# EAGLE design SELFiSSH (EAGLE 6.2)

## Sheet 1 of 5: Supply or Battery Mode
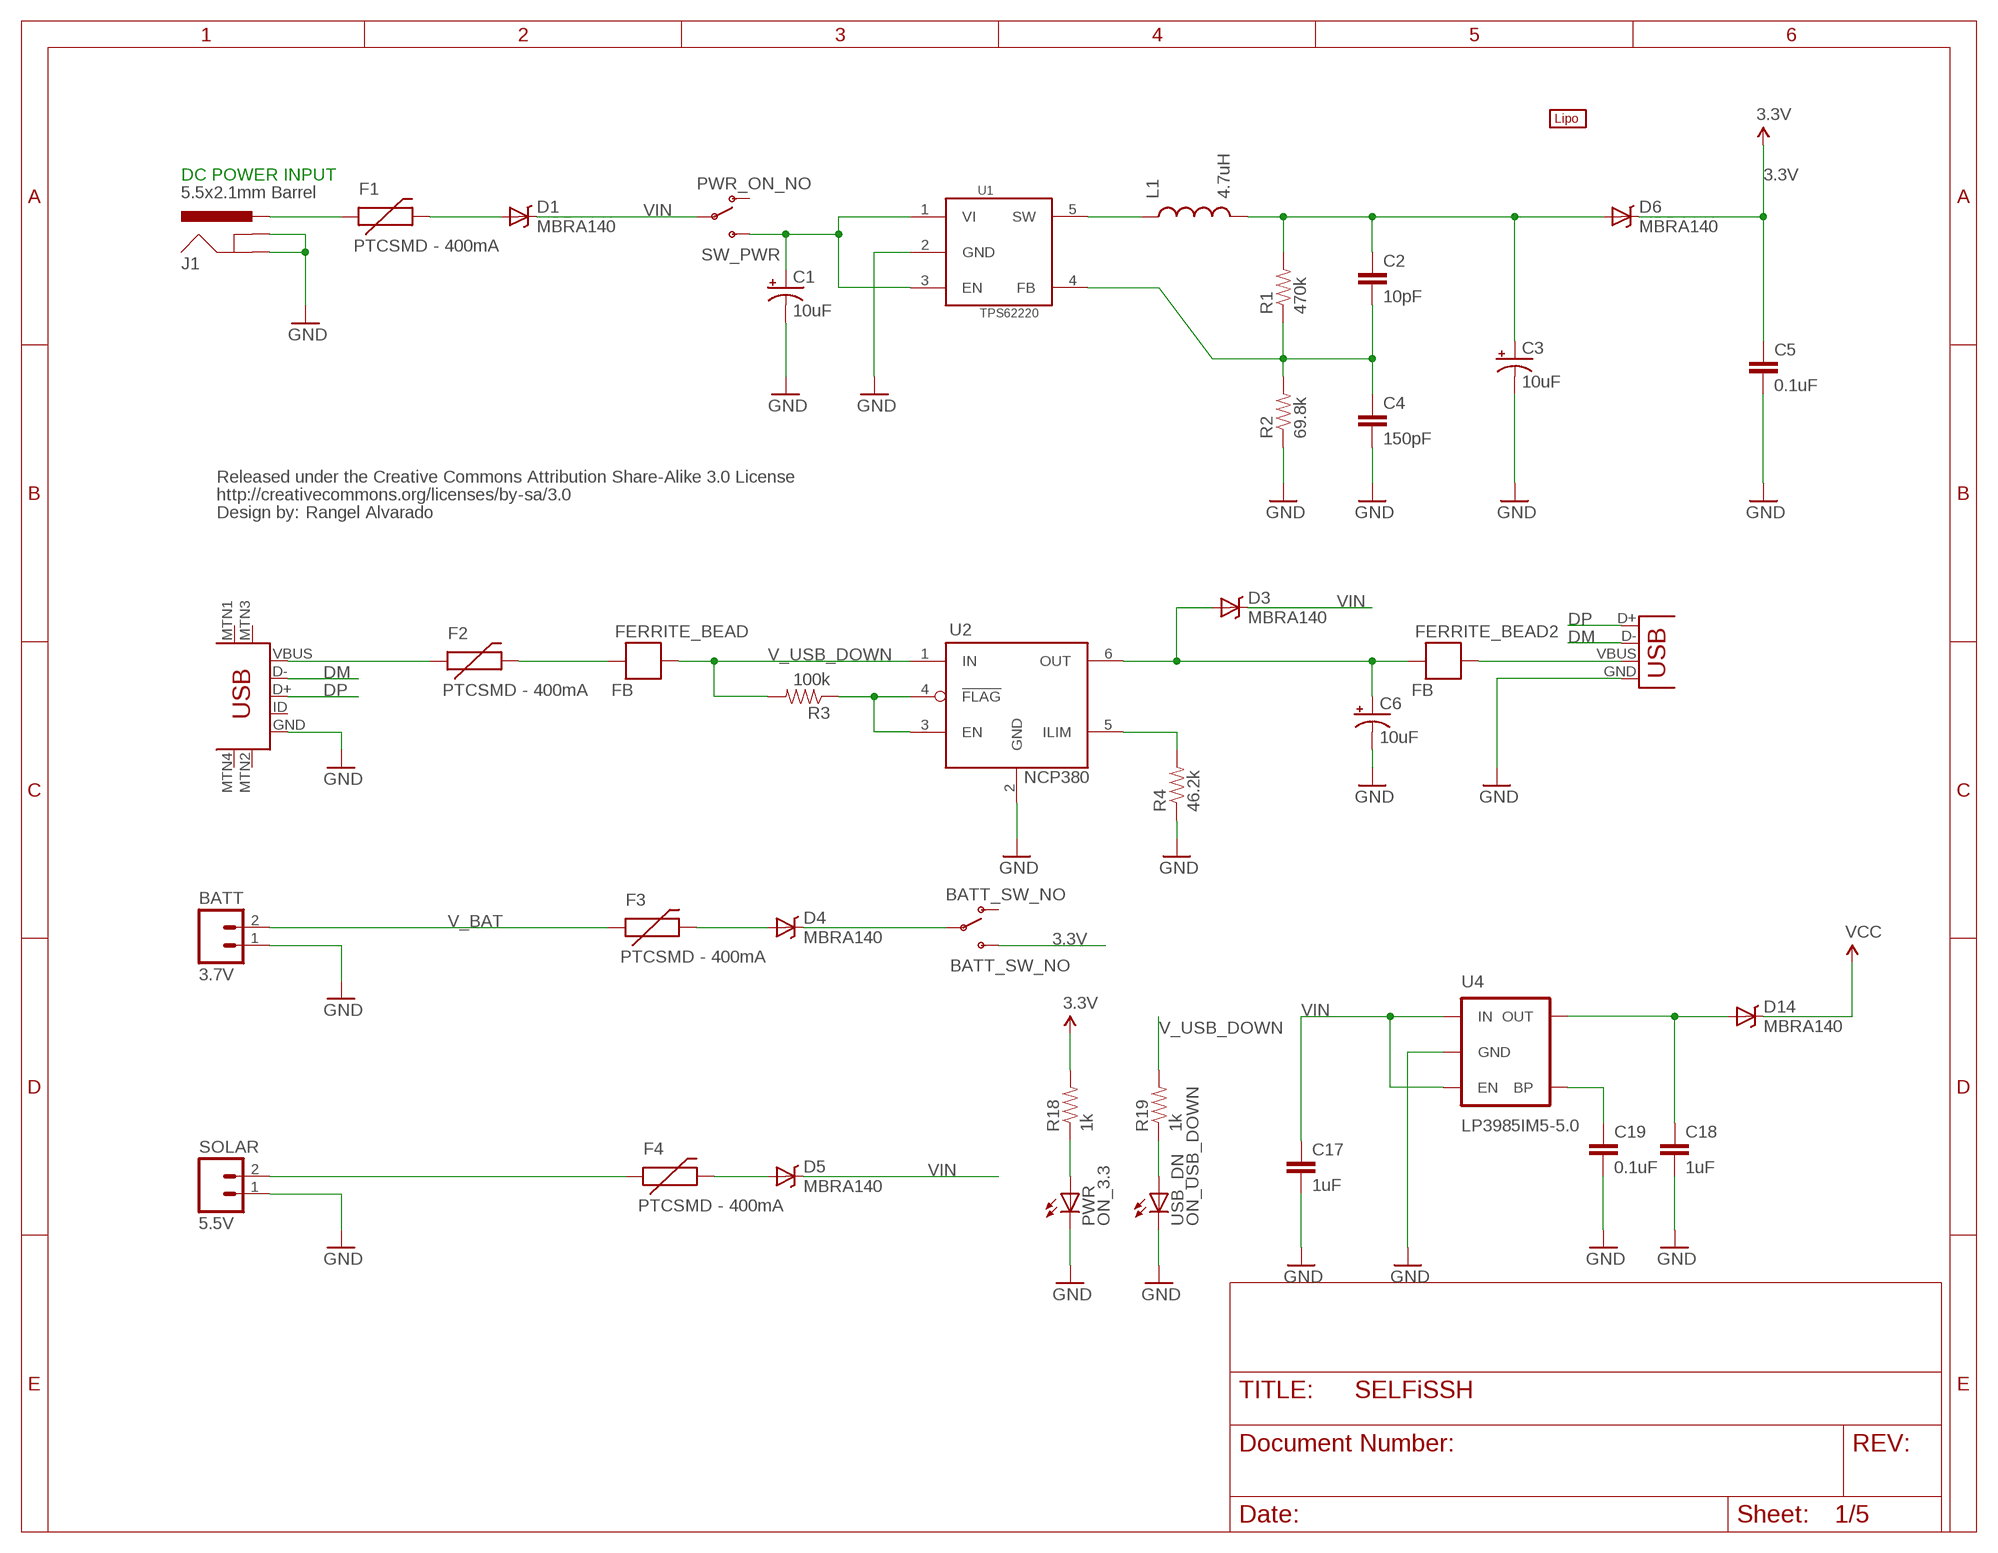
[diagram p0: schematic, sheet 1]

### Parts
BATT  3.7V  M02JST-PTH-2  [JST-2-PTH]
BATT_SW_NO  BATT_SW_NO  SWITCH-SPDTSMD2  [SWITCH-SPDT-SMD]
C1  10uF  10UF-16V-10%(TANT)  [EIA3216]
C2  10pF  1UF-25V-10%(0805)  [0805]
C3  10uF  10UF-16V-10%(TANT)  [EIA3216]
C4  150pF  1UF-25V-10%(0805)  [0805]
C5  0.1uF  1UF-25V-10%(0805)  [0805]
C6  10uF  10UF-16V-10%(TANT)  [EIA3216]
C17  1uF  1UF-25V-10%(0805)  [0805]
C18  1uF  1UF-25V-10%(0805)  [0805]
C19  0.1uF  1UF-25V-10%(0805)  [0805]
CC_TEXT1  CREATIVE_COMMONS  [CREATIVE_COMMONS]
D1  MBRA140  [SMA-DIODE]
D3  MBRA140  [SMA-DIODE]
D4  MBRA140  [SMA-DIODE]
D5  MBRA140  [SMA-DIODE]
D6  MBRA140  [SMA-DIODE]
D14  MBRA140  [SMA-DIODE]
F1  PTCSMD - 400mA  PTCSMD  [PTC-1206]
F2  PTCSMD - 400mA  PTCSMD  [PTC-1206]
F3  PTCSMD - 400mA  PTCSMD  [PTC-1206]
F4  PTCSMD - 400mA  PTCSMD  [PTC-1206]
FERRITE_BEAD  FB  [0603]
FERRITE_BEAD2  FB  [0603]
J1  5.5x2.1mm Barrel  POWER_JACKSMD  [POWER_JACK_SMD]
L1  4.7uH  INDUCTOR0805  [0805]
PWR  ON_3.3  LED0603  [LED-0603]
R1  470k  RESISTOR0603-RES  [0603-RES]
R2  69.8k  RESISTOR0603-RES  [0603-RES]
R3  100k  RESISTOR0603-RES  [0603-RES]
R4  46.2k  RESISTOR0603-RES  [0603-RES]
R18  1k  RESISTOR0603-RES  [0603-RES]
R19  1k  RESISTOR0603-RES  [0603-RES]
SOLAR  5.5V  M02JST-PTH-2  [JST-2-PTH]
SW_PWR  PWR_ON_NO  SWITCH-SPDTSMD2  [SWITCH-SPDT-SMD]
U1  TPS62220  [TSOT-23-5]
U2  NCP380  NCP380VCC5NCP380  [TSOP6]
U4  LP3985IM5-5.0  V_REG_LDOSMD  [SOT23-5]
U$7  LIPO-OUTLINE1100  [LIPO-1100]
USB_DN  ON_USB_DOWN  LED0603  [LED-0603]
USB_IN  USB_IN  USB-MINIB-5PIN  [USB-MINIB]
USB_OUT  USB_OUT  USB_  [USB-A-S-SILK-FEMALE]

### Nets
3.3V: BATT_SW_NO.3(S) C5.1 D6.C R18.2 ; also sheet 2,4,5
DM: USB_IN.D- USB_OUT.D-
DP: USB_IN.D+ USB_OUT.D+
GND: BATT.1 C1.C(-) C3.C(-) C4.2 C5.2 C6.C(-) C17.2 C18.2 C19.2 J1.GND(GNDBREAK) J1.P$4(GND) PWR.C R2.1 R4.1 SOLAR.1 U1.2(GND) U2.2(GND) U4.2(GND) USB_DN.C USB_IN.GND USB_OUT.GND ; also sheet 2,3,4,5
N$1: F2.1 USB_IN.VBUS
N$2: BATT_SW_NO.2(P) D4.C
N$3: L1.1 U1.5(SW)
N$4: F2.2 FERRITE_BEAD.2
N$5: C2.1 C3.A(+) D6.A L1.2 R1.2
N$7: F1.1 J1.VIN0(PWR)
N$8: D1.A F1.2
N$9: D4.A F3.2
N$11: R3.1 U2.3(EN) U2.4(!FLAG)
N$12: D5.A F4.2
N$14: C2.2 C4.1 R1.1 R2.2 U1.4(FB)
N$16: R4.2 U2.5(ILIM)
N$35: PWR.A R18.1
N$38: R19.1 USB_DN.A
N$39: C6.A(+) D3.A FERRITE_BEAD2.2 U2.6(OUT)
N$40: C1.A(+) SW_PWR.3(S) U1.1(VI) U1.3(EN)
N$41: C19.1 U4.4(BP)
N$42: C18.1 D14.A U4.5(OUT)
N$49: FERRITE_BEAD2.1 USB_OUT.VBUS
SUN: F4.1 SOLAR.2
V_BAT: BATT.2 F3.1 ; also sheet 3
V_USB_DOWN: FERRITE_BEAD.1 R3.2 R19.2 U2.1(IN)
VCC: D14.C ; also sheet 4
VIN: C17.1 D1.C D3.C D5.C SW_PWR.2(P) U4.1(IN) U4.3(EN) ; also sheet 3,4
Unconnected: BATT_SW_NO.1(O) SW_PWR.1(O) USB_IN.ID USB_IN.MTN1(MTN2) USB_IN.MTN2(MTN3) USB_IN.MTN3(MTN1) USB_IN.MTN4

### Notes on the sheet
- DC POWER INPUT
- Rangel Alvarado

## Sheet 2 of 5: RS232 Interface
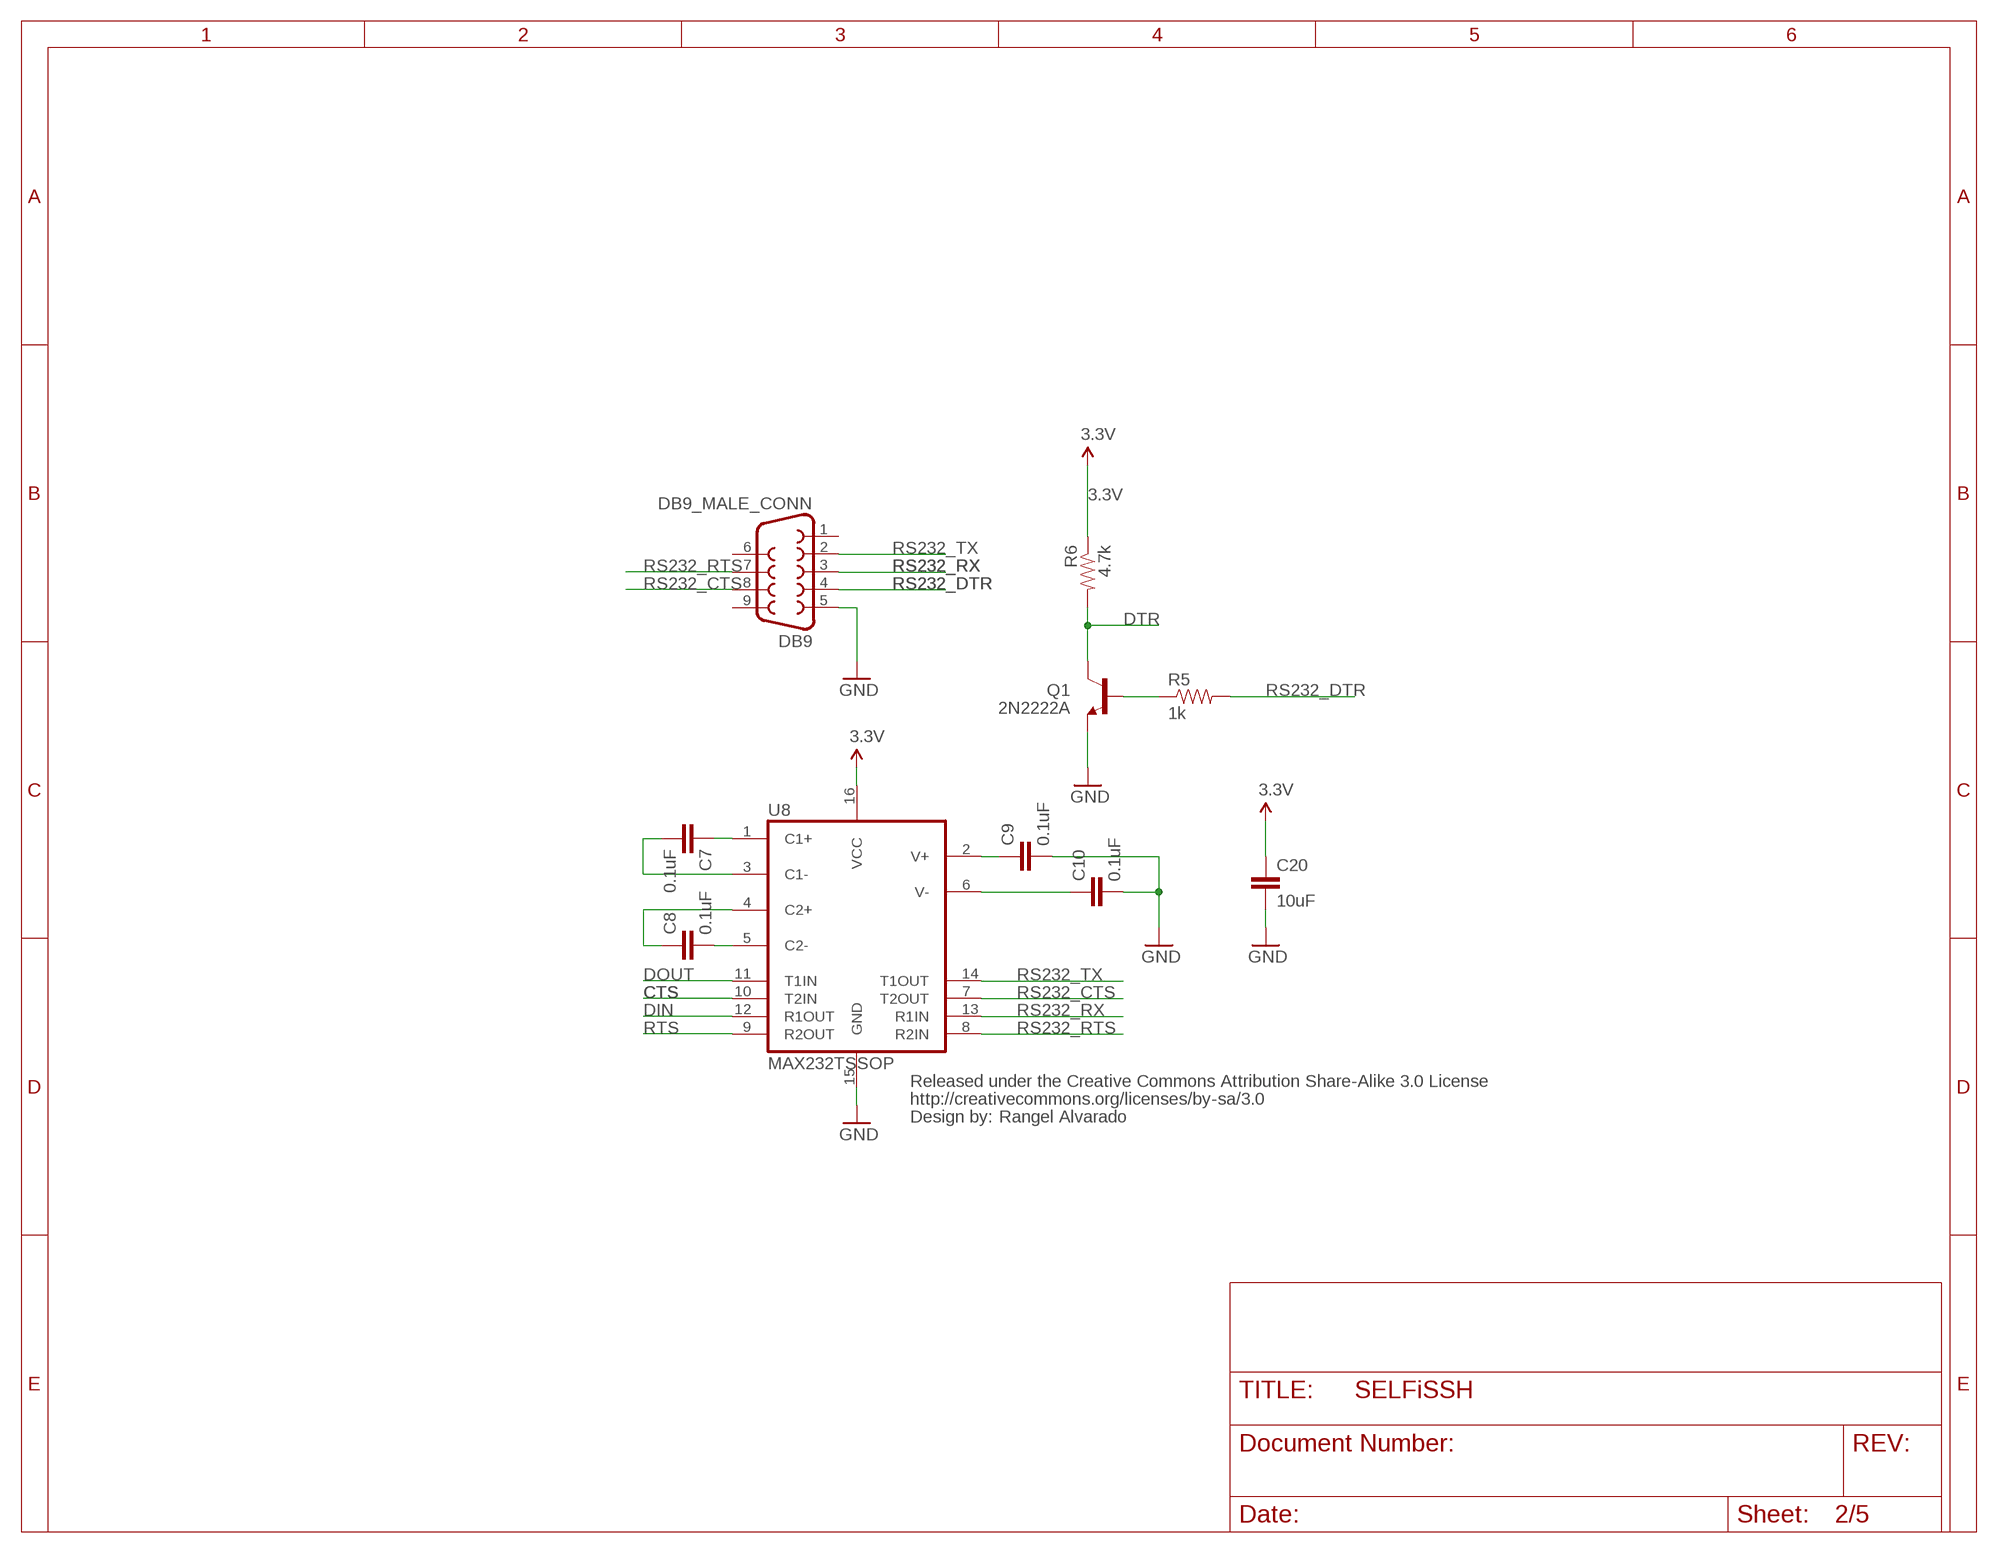
[diagram p1: schematic, sheet 2]

### Parts
C7  0.1uF  .1UF-CER  [0402-CAP]
C8  0.1uF  .1UF-CER  [0402-CAP]
C9  0.1uF  .1UF-CER  [0402-CAP]
C10  0.1uF  .1UF-CER  [0402-CAP]
C20  10uF  .1UF-CER  [0402-CAP]
CC_TEXT2  CREATIVE_COMMONS  [CREATIVE_COMMONS]
DB9_MALE_CONN  DB9  F09HP  [F09HP]
Q1  2N2222A  TRANSISTOR_NPNSOT23-3  [SOT23-3]
R5  1k  RESISTOR0402-RES  [0402-RES]
R6  4.7k  RESISTOR0402-RES  [0402-RES]
U8  MAX232TSSOP  [TSSOP16]

### Nets
3.3V: C20.1 R6.1 U8.16(VCC) ; also sheet 1,4,5
CTS: U8.10(T2IN) ; also sheet 4,5
DIN: U8.12(R1OUT) ; also sheet 4,5
DOUT: U8.11(T1IN) ; also sheet 4,5
DTR: Q1.3(C) R6.2 ; also sheet 4,5
GND: C9.2 C10.2 C20.2 DB9_MALE_CONN.5 Q1.2(E) U8.15(GND) ; also sheet 1,3,4,5
N$18: C9.1 U8.2(V+)
N$19: C10.1 U8.6(V-)
N$20: C8.2 U8.5(C2-)
N$21: C7.2 U8.3(C1-)
N$22: C7.1 U8.1(C1+)
N$23: C8.1 U8.4(C2+)
N$24: Q1.1(B) R5.1
RS232_CTS: DB9_MALE_CONN.8 U8.7(T2OUT)
RS232_DTR: DB9_MALE_CONN.4 R5.2
RS232_RTS: DB9_MALE_CONN.7 U8.8(R2IN)
RS232_RX: DB9_MALE_CONN.3 U8.13(R1IN)
RS232_TX: DB9_MALE_CONN.2 U8.14(T1OUT)
RTS: U8.9(R2OUT) ; also sheet 4,5
Unconnected: DB9_MALE_CONN.1 DB9_MALE_CONN.6 DB9_MALE_CONN.9

### Notes on the sheet
- Rangel Alvarado

## Sheet 3 of 5: Li-On/Li-Pol Battery Charger
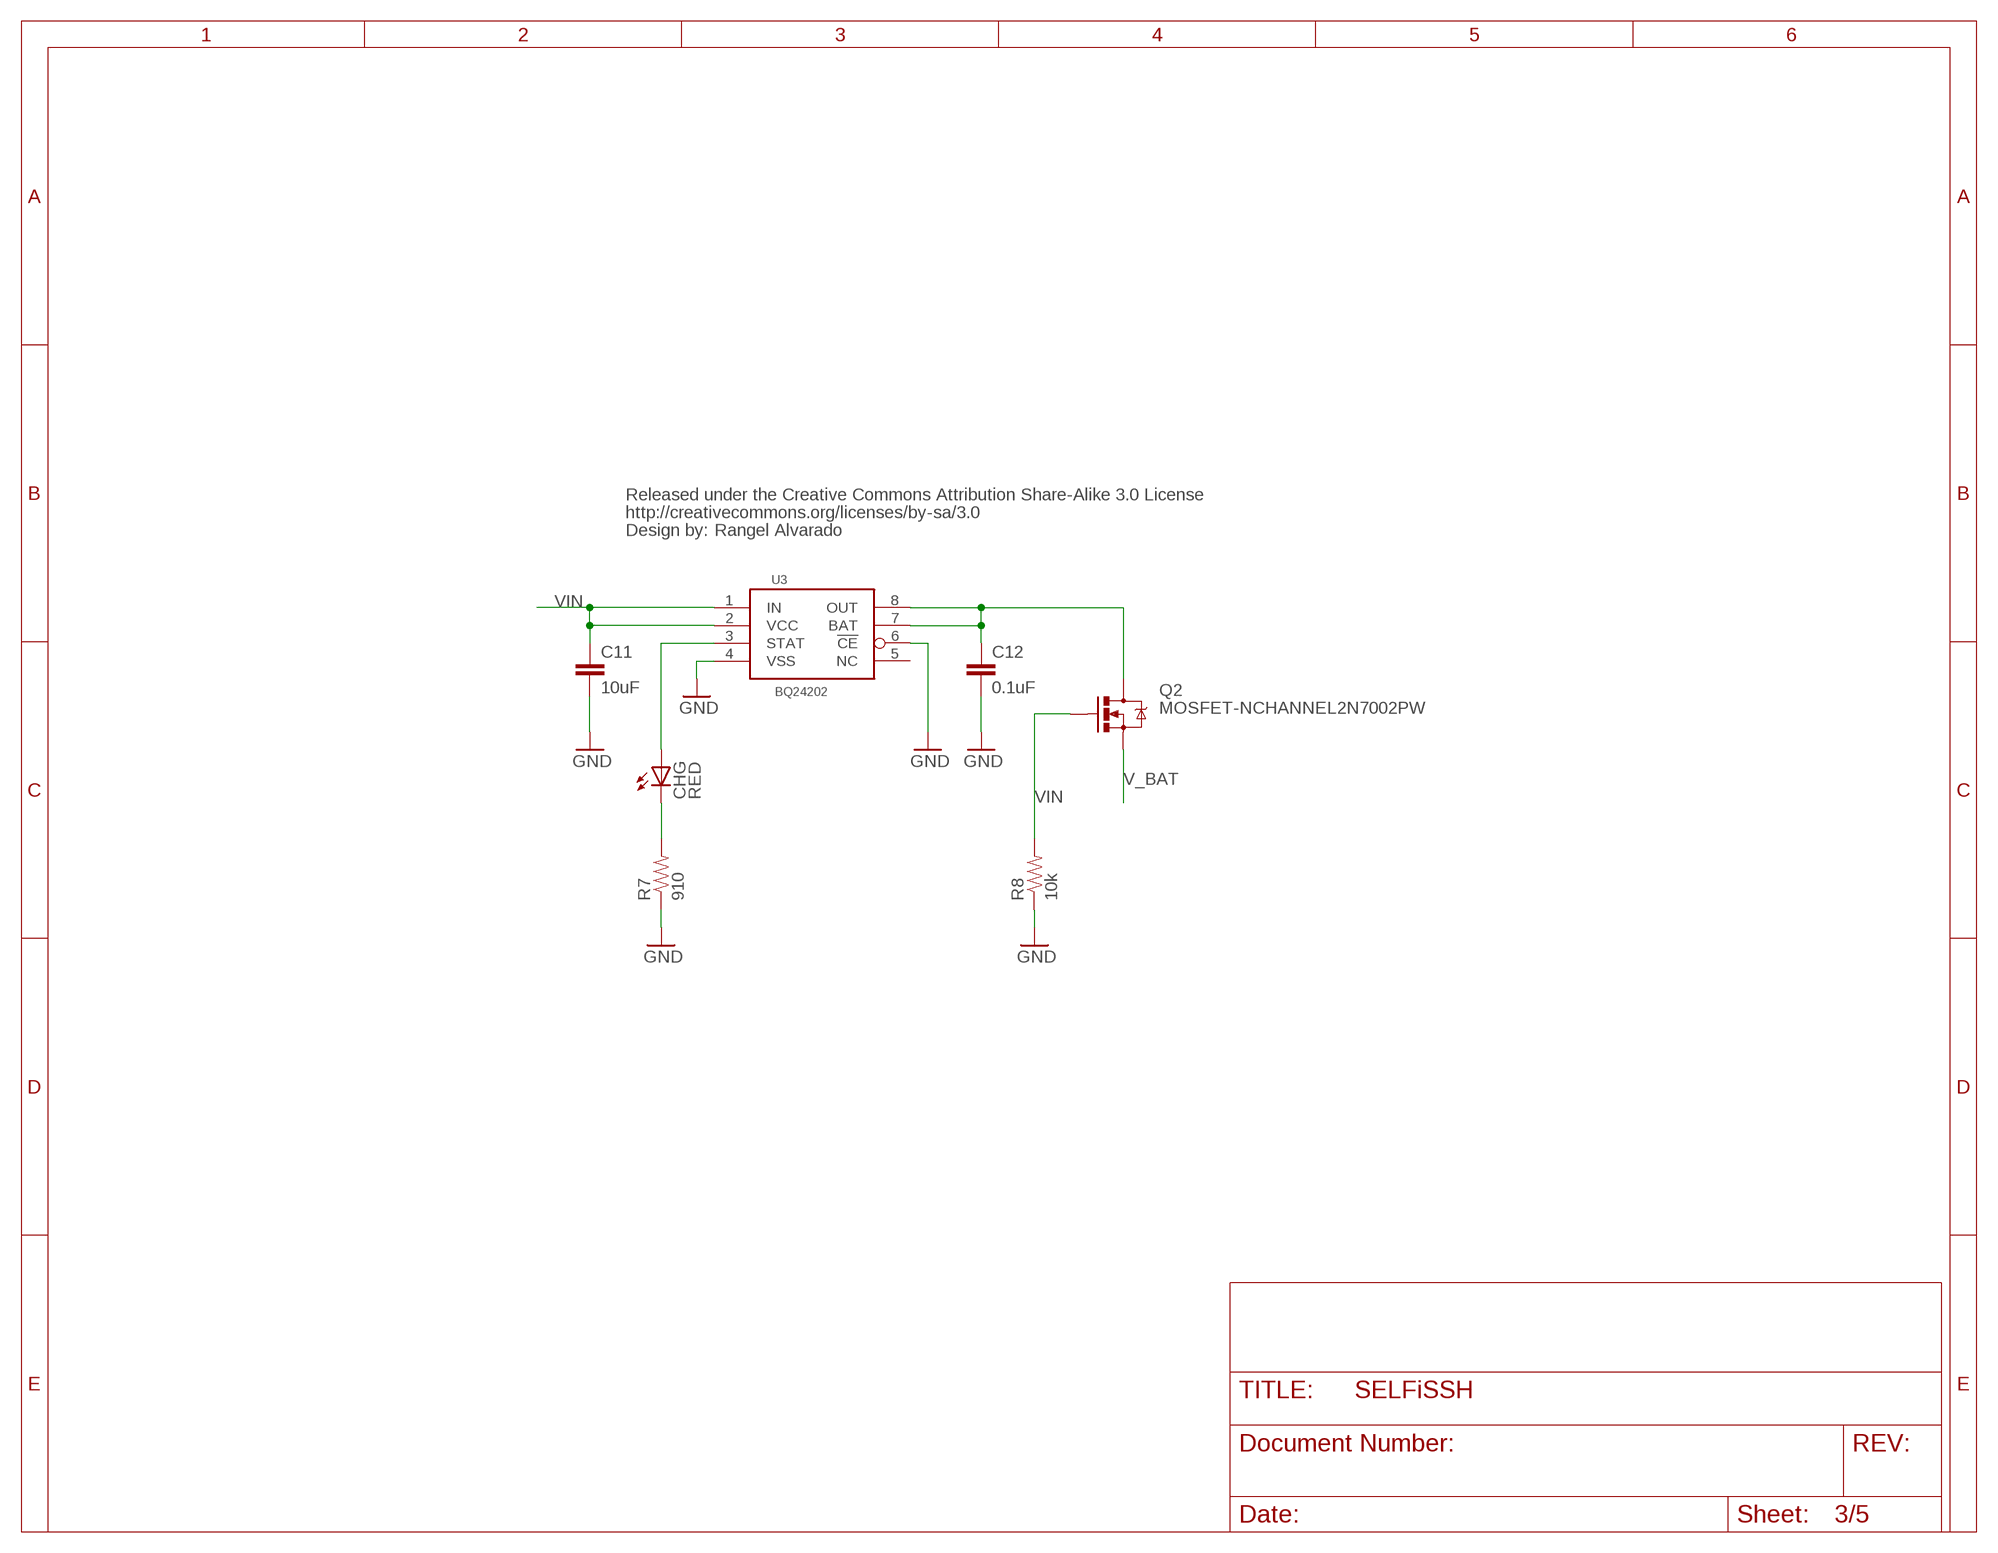
[diagram p2: schematic, sheet 3]

### Parts
C11  10uF  CAP0805  [0805]
C12  0.1uF  CAP0805  [0805]
CC_TEXT3  CREATIVE_COMMONS  [CREATIVE_COMMONS]
CHG  RED  LED-RED1206  [LED-1206]
Q2  MOSFET-NCHANNEL2N7002PW  [SOT323]
R7  910  RESISTOR0805-RES  [0805]
R8  10k  RESISTOR0805-RES  [0805]
U3  BQ24202  [MSOP-8]

### Nets
GND: C11.2 C12.2 R7.1 R8.1 U3.4(VSS) U3.6(!CE) ; also sheet 1,2,4,5
N$10: CHG.A U3.3(STAT)
N$25: CHG.C R7.2
N$43: C12.1 Q2.3(D) U3.7(BAT) U3.8(OUT)
V_BAT: Q2.2(S) ; also sheet 1
VIN: C11.1 Q2.1(G) R8.2 U3.1(IN) U3.2(VCC) ; also sheet 1,4
Unconnected: U3.5(NC)

### Notes on the sheet
- Rangel Alvarado

## Sheet 4 of 5: XV FTDI Interface + RS485
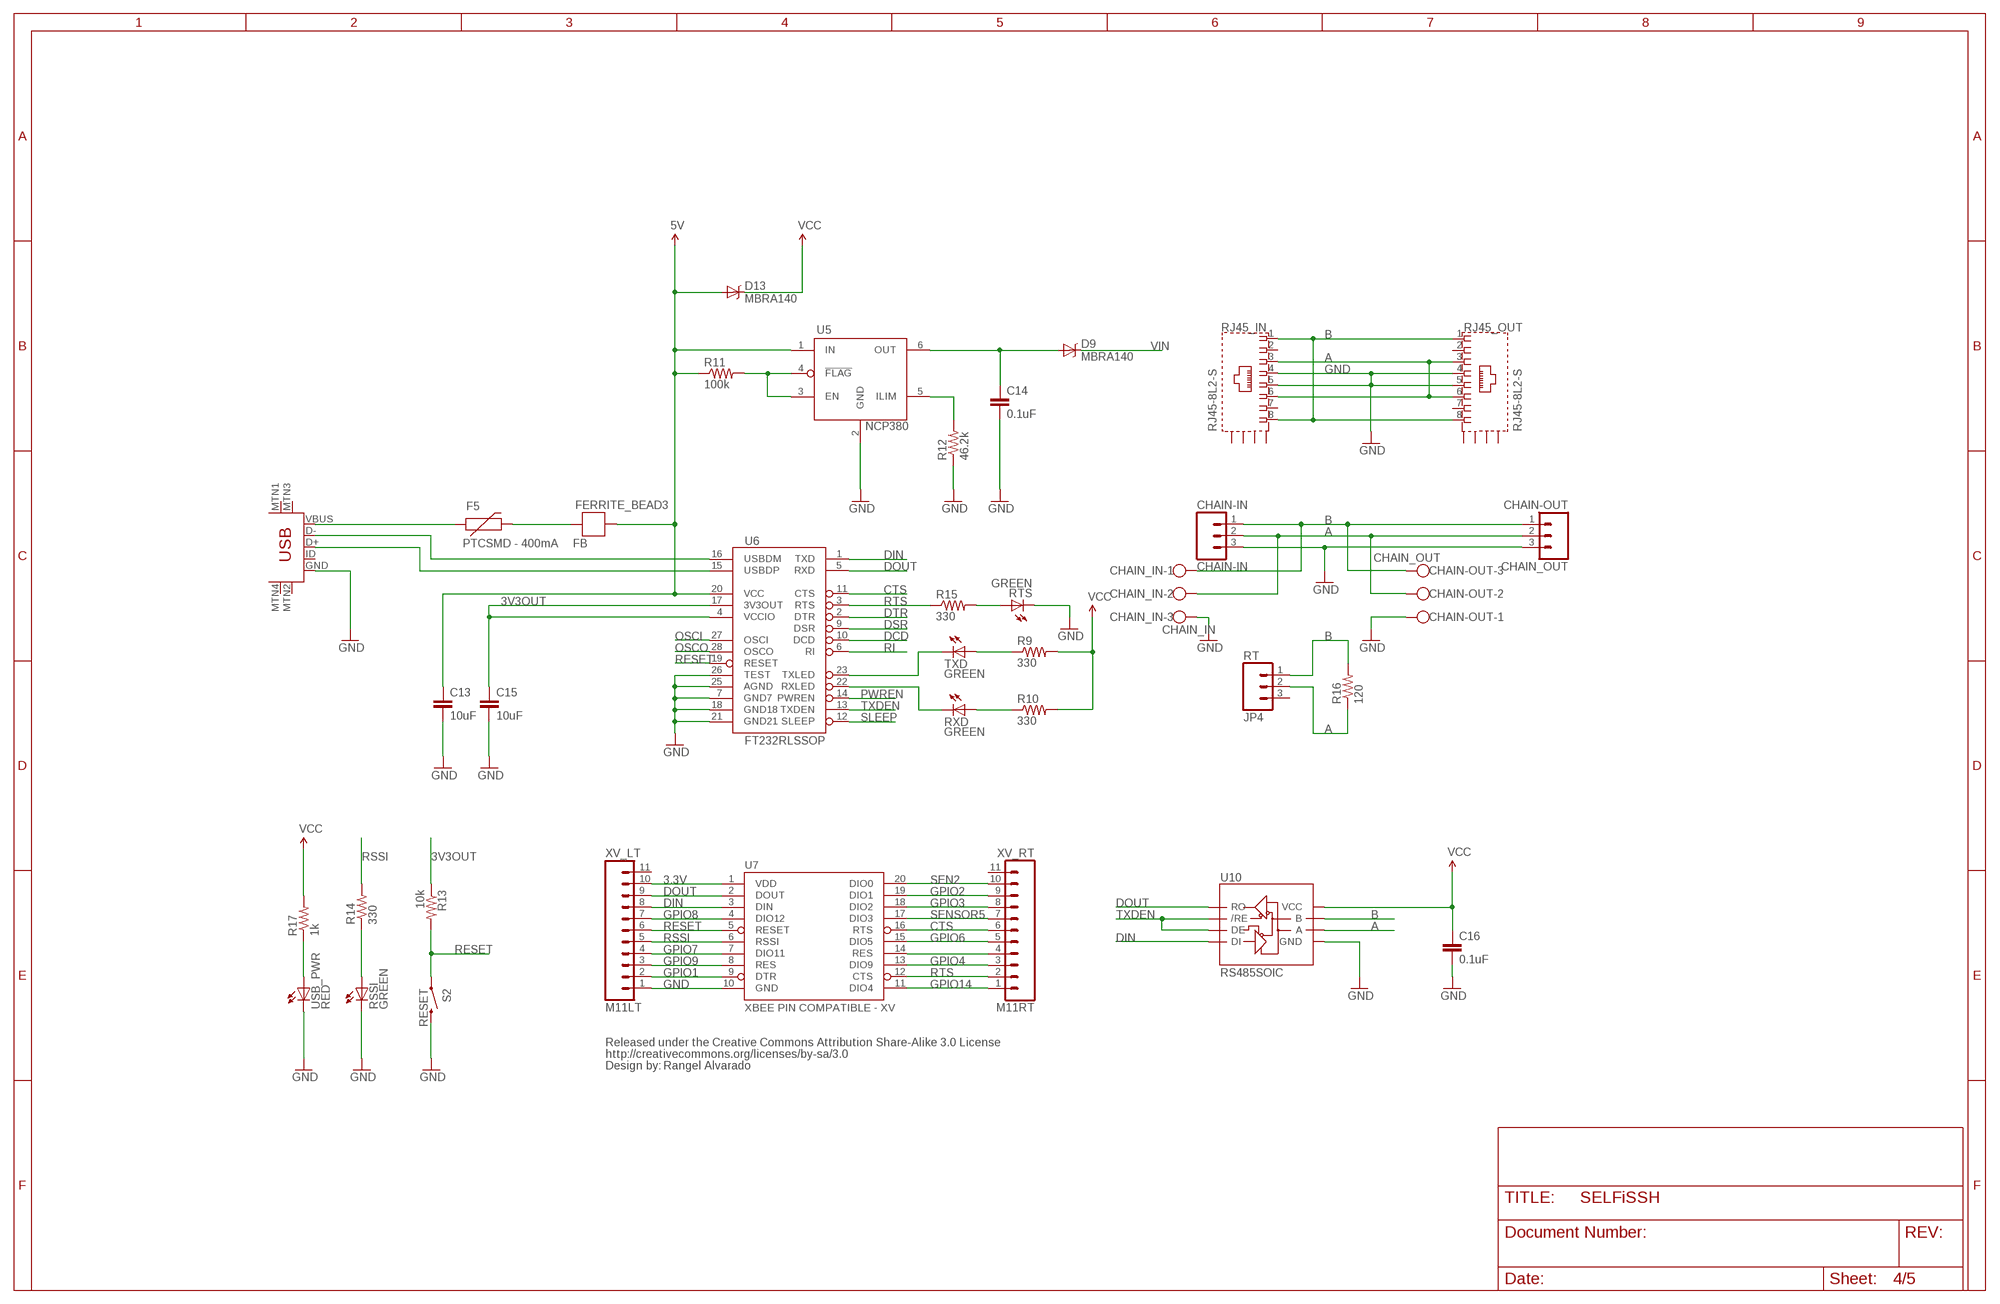
[diagram p3: schematic, sheet 4]

### Parts
C13  10uF  CAP0805  [0805]
C14  0.1uF  CAP0805  [0805]
C15  10uF  CAP0805  [0805]
C16  0.1uF  CAP0805  [0805]
CC_TEXT4  CREATIVE_COMMONS  [CREATIVE_COMMONS]
CHAIN-IN  CHAIN-IN  M03LONGPADS  [1X03_LONGPADS]
CHAIN-OUT  CHAIN_OUT  W237-103  [W237-103]
CHAIN_IN  CHAIN_IN  W237-103  [W237-103]
CHAIN_OUT  CHAIN-OUT  M03LONGPADS  [1X03_LONGPADS]
D9  MBRA140  [SMA-DIODE]
D13  MBRA140  [SMA-DIODE]
F5  PTCSMD - 400mA  PTCSMD  [PTC-1206]
FERRITE_BEAD3  FB  [0603]
FTDI  FTDI  USB-MINIB-5PIN  [USB-MINIB]
JP4  RT  M03LONGPADS  [1X03_LONGPADS]
R9  330  RESISTOR0805-RES  [0805]
R10  330  RESISTOR0805-RES  [0805]
R11  100k  RESISTOR0805-RES  [0805]
R12  46.2k  RESISTOR0805-RES  [0805]
R13  10k  RESISTOR0805-RES  [0805]
R14  330  RESISTOR0805-RES  [0805]
R15  330  RESISTOR0805-RES  [0805]
R16  120  RESISTOR0805-RES  [0805]
R17  1k  RESISTOR0805-RES  [0805]
RJ45_IN  RJ45-8L2-S  [RJ45-SHIELD2]
RJ45_OUT  RJ45-8L2-S  [RJ45-SHIELD2]
RSSI  GREEN  LED-GREEN0603  [LED-0603]
RTS  GREEN  LED0603  [LED-0603]
RXD  GREEN  LED0603  [LED-0603]
S2  RESET  SWITCH-MOMENTARY-2  [TACTILE_SWITCH_TALL]
TXD  GREEN  LED0603  [LED-0603]
U5  NCP380  NCP380VCC5NCP380  [TSOP6]
U6  FT232RLSSOP  [SSOP28DB]
U7  XBEE PIN COMPATIBLE - XV  XBEE-1B3  [XBEE-SMD]
U10  RS485SOIC  [SO08]
USB_PWR  RED  LED1206  [LED-1206]
XV_LT  M11LT  M11LONGPADS  [1X11_LONGPADS]
XV_RT  M11RT  M11LONGPADS  [1X11_LONGPADS]

### Nets
3.3V: U7.1(VDD) XV_LT.10 ; also sheet 1,2,5
3V3OUT: C15.1 R13.1 U6.4(VCCIO) U6.17(3V3OUT)
5V: C13.1 D13.A FERRITE_BEAD3.1 R11.1 U5.1(IN) U6.20(VCC)
A: CHAIN-IN.2 CHAIN-OUT.2 CHAIN_IN.2 CHAIN_OUT.2 JP4.2 R16.1 RJ45_IN.3 RJ45_IN.6 RJ45_OUT.3 RJ45_OUT.6 U10.6(A)
B [GND]: CHAIN-IN.1 CHAIN-OUT.3 CHAIN_IN.1 CHAIN_OUT.1 JP4.1 R16.2 RJ45_IN.1 RJ45_IN.8 RJ45_OUT.1 RJ45_OUT.8 U10.7(B)
CTS: U6.11(CTS) U7.16(RTS) XV_RT.6 ; also sheet 2,5
DCD: U6.10(DCD)
DIN: U6.1(TXD) U7.3(DIN) U10.4(DI) XV_LT.8 ; also sheet 2,5
DOUT: U6.5(RXD) U7.2(DOUT) U10.1(RO) XV_LT.9 ; also sheet 2,5
DSR: U6.9(DSR) ; also sheet 5
DTR: U6.2(DTR) ; also sheet 2,5
FTDI: FTDI.D+ U6.15(USBDP)
GND: C13.2 C14.2 C15.2 C16.2 CHAIN-IN.3 CHAIN-OUT.1 CHAIN_IN.3 CHAIN_OUT.3 FTDI.GND R12.1 RJ45_IN.4 RJ45_IN.5 RJ45_OUT.4 RJ45_OUT.5 RSSI.C RTS.C S2.B2 U5.2(GND) U6.7(GND7) U6.18(GND18) U6.21(GND21) U6.25(AGND) U6.26(TEST) U7.10(GND) U10.5(GND) USB_PWR.C XV_LT.1 ; also sheet 1,2,3,5
GPIO1: U7.9(DTR) XV_LT.2
GPIO2: U7.19(DIO1) XV_RT.9
GPIO3: U7.18(DIO2) XV_RT.8
GPIO4: U7.13(DIO9) XV_RT.3
GPIO6: U7.15(DIO5) XV_RT.5
GPIO7: U7.7(DIO11) XV_LT.4
GPIO8: U7.4(DIO12) XV_LT.7
GPIO9: U7.8(RES) XV_LT.3
GPIO14: U7.11(DIO4) XV_RT.1
N$13: F5.1 FTDI.VBUS
N$15: F5.2 FERRITE_BEAD3.2
N$17: FTDI.D- U6.16(USBDM)
N$27: R15.2 RTS.A
N$28: RXD.C U6.22(RXLED)
N$29: TXD.C U6.23(TXLED)
N$30: R9.1 TXD.A
N$31: R10.1 RXD.A
N$32: C14.1 D9.A U5.6(OUT)
N$33: R14.1 RSSI.A
N$34: R11.2 U5.3(EN) U5.4(!FLAG)
N$36: R17.1 USB_PWR.A
N$37: R12.2 U5.5(ILIM)
N$44: U7.14(RES) XV_RT.4
OSCI: U6.27(OSCI)
OSCO: U6.28(OSCO)
PWREN: U6.14(PWREN)
RESET: R13.2 S2.A2 U6.19(RESET) U7.5(RESET) XV_LT.6
RI: U6.6(RI) ; also sheet 5
RSSI: R14.2 U7.6(RSSI) XV_LT.5
RTS: R15.1 U6.3(RTS) U7.12(CTS) XV_RT.2 ; also sheet 2,5
SEN2: U7.20(DIO0) XV_RT.10
SENSOR5: U7.17(DIO3) XV_RT.7
SLEEP: U6.12(SLEEP)
TXDEN: U6.13(TXDEN) U10.2(/RE) U10.3(DE)
VCC: C16.1 D13.C R9.2 R10.2 R17.2 U10.8(VCC) ; also sheet 1
VIN: D9.C ; also sheet 1,3
Unconnected: FTDI.ID FTDI.MTN1(MTN2) FTDI.MTN2(MTN3) FTDI.MTN3(MTN1) FTDI.MTN4 JP4.3 RJ45_IN.2 RJ45_IN.7 RJ45_IN.S1(S) RJ45_IN.S2(S) RJ45_IN.S3(S) RJ45_IN.S4(S) RJ45_OUT.2 RJ45_OUT.7 RJ45_OUT.S1(S) RJ45_OUT.S2(S) RJ45_OUT.S3(S) RJ45_OUT.S4(S) XV_LT.11 XV_RT.11

### Notes on the sheet
- Rangel Alvarado

## Sheet 5 of 5: IrDA Interface + Board
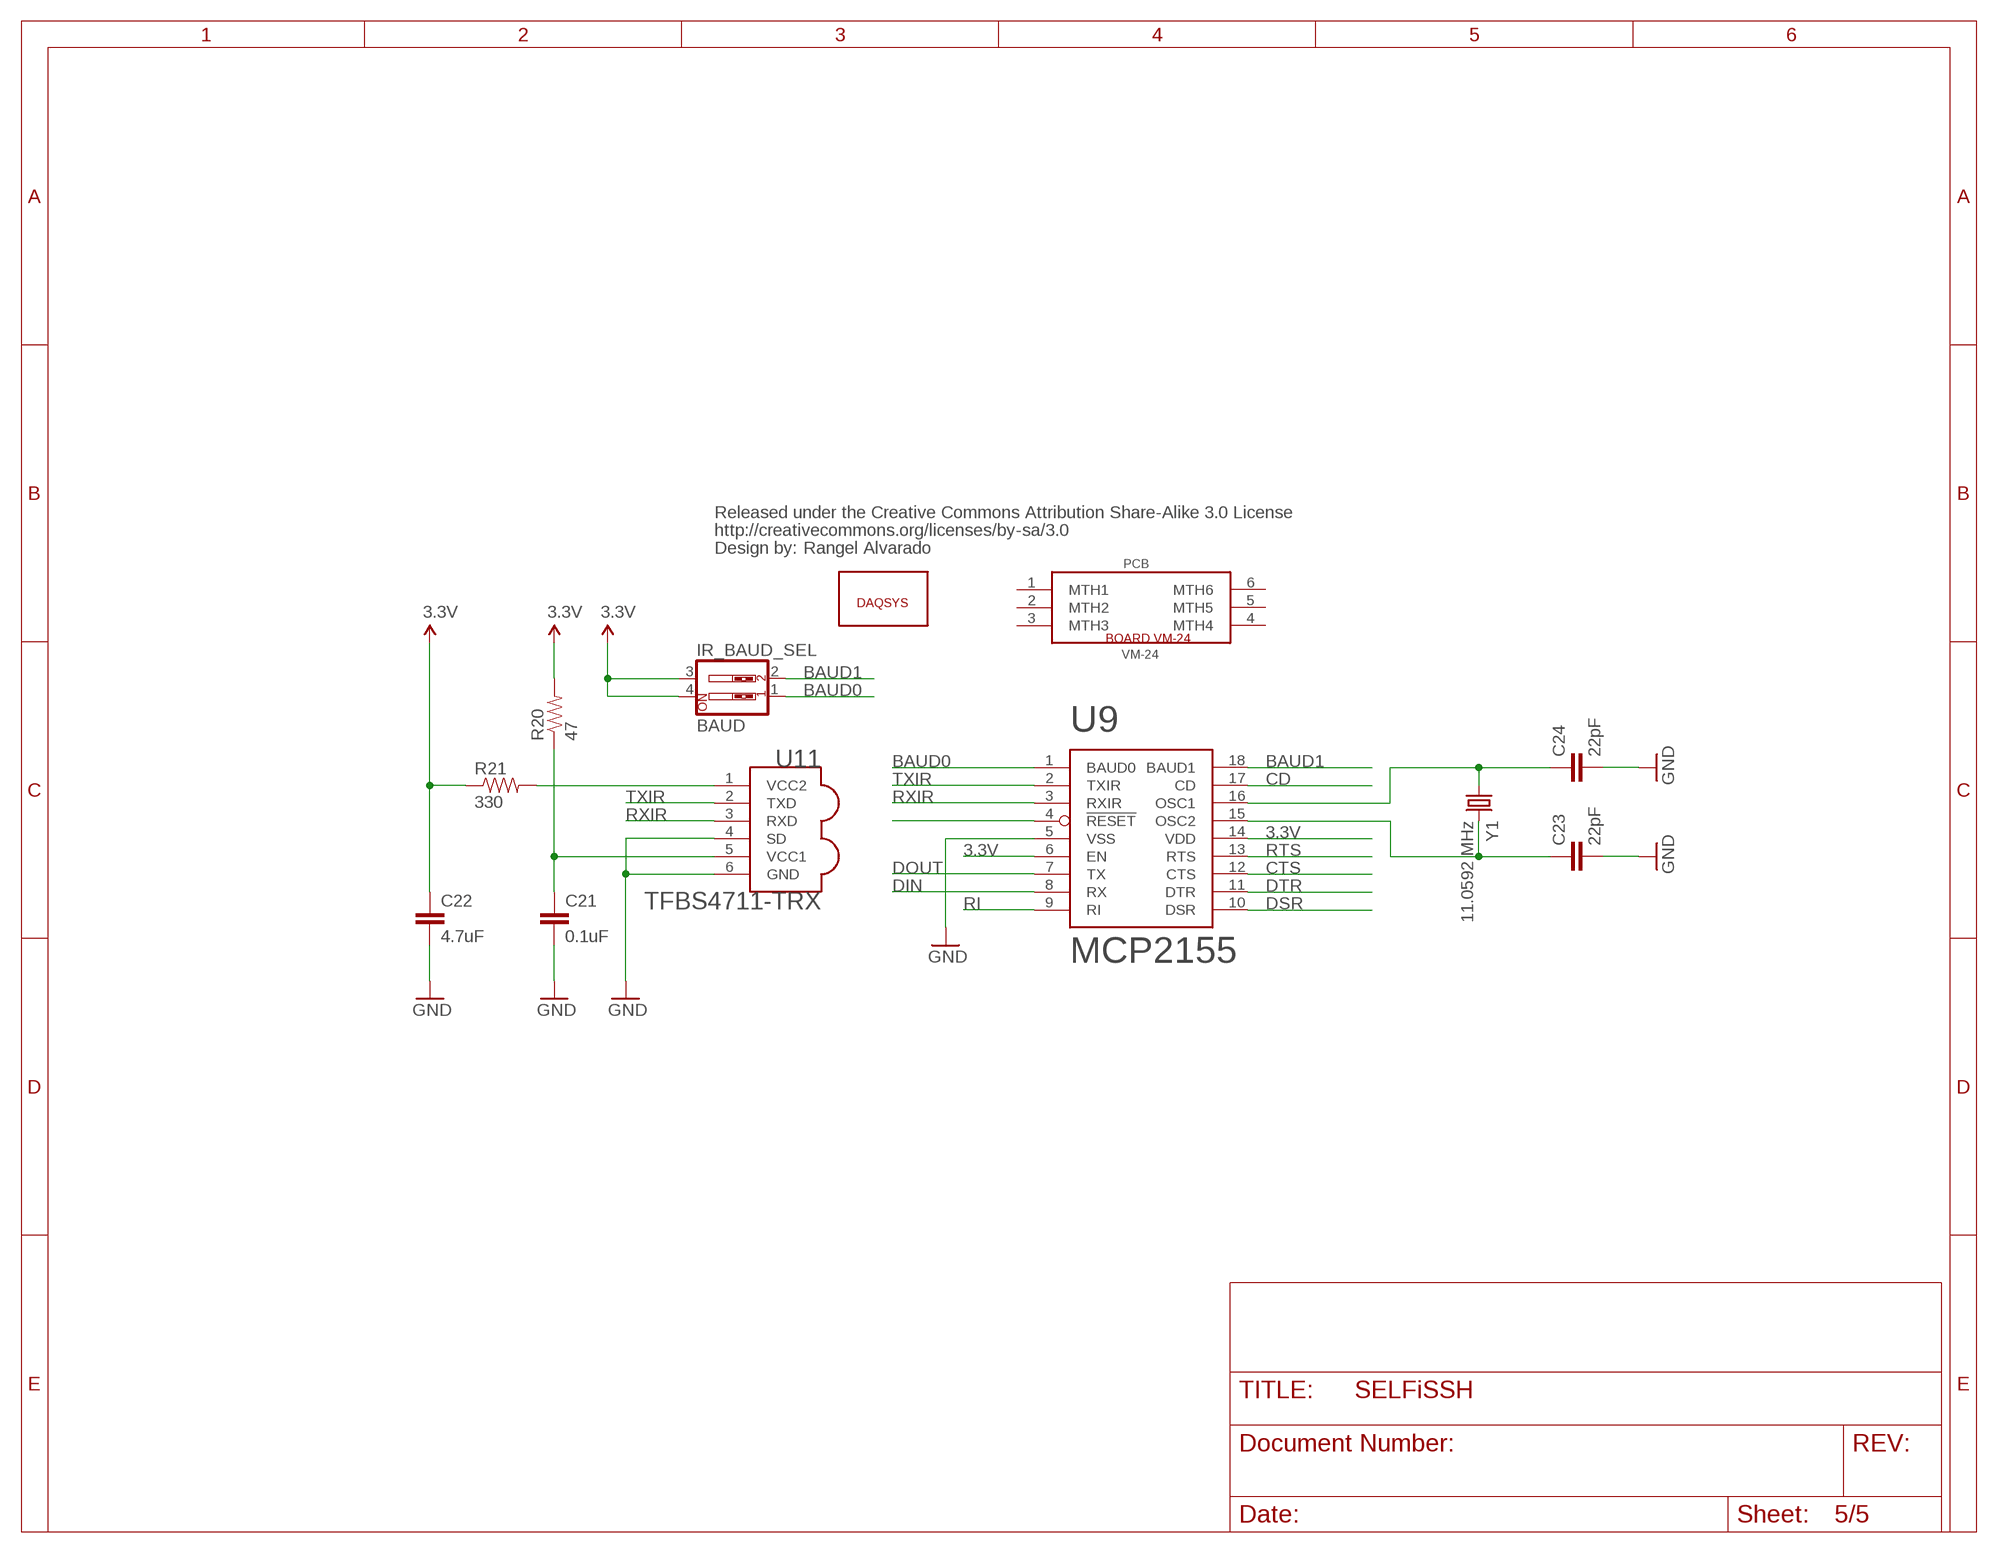
[diagram p4: schematic, sheet 5]

### Parts
C21  0.1uF  CAP0603-CAP  [0603-CAP]
C22  4.7uF  CAP0603-CAP  [0603-CAP]
C23  22pF  CAP0603-CAP  [0603-CAP]
C24  22pF  CAP0603-CAP  [0603-CAP]
CC_TEXT5  CREATIVE_COMMONS  [CREATIVE_COMMONS]
IR_BAUD_SEL  BAUD  SW_DIP-2  [DIPSWITCH-02]
PCB  VM-24  [VM-24]
R20  47  RESISTOR0603-RES  [0603-RES]
R21  330  RESISTOR0603-RES  [0603-RES]
U9  MCP2155  [SOIC18-W]
U11  TFBS4711-TRX  [SMD-6]
U$1  DAQSYS  [DAQSYS]
Y1  11.0592 MHz  CRYSTAL5X3  [CRYSTAL-SMD-5X3]

### Nets
3.3V: C22.1 IR_BAUD_SEL.3 IR_BAUD_SEL.4 R20.2 R21.1 U9.6(EN) U9.14(VDD) ; also sheet 1,2,4
BAUD0: IR_BAUD_SEL.1 U9.1(BAUD0)
BAUD1: IR_BAUD_SEL.2 U9.18(BAUD1)
CD: U9.17(CD)
CTS: U9.12(CTS) ; also sheet 2,4
DIN: U9.8(RX) ; also sheet 2,4
DOUT: U9.7(TX) ; also sheet 2,4
DSR: U9.10(DSR) ; also sheet 4
DTR: U9.11(DTR) ; also sheet 2,4
GND: C21.2 C22.2 C23.2 C24.2 U9.5(VSS) U11.4(SD) U11.6(GND) ; also sheet 1,2,3,4
N$45: C21.1 R20.1 U11.5(VCC1)
N$46: C24.1 U9.16(OSC1) Y1.1
N$47: C23.1 U9.15(OSC2) Y1.3
N$48: U9.4(!RESET)
N$50: R21.2 U11.1(VCC2)
RI: U9.9(RI) ; also sheet 4
RTS: U9.13(RTS) ; also sheet 2,4
RXIR: U9.3(RXIR) U11.3(RXD)
TXIR: U9.2(TXIR) U11.2(TXD)
Unconnected: PCB.1(MTH1) PCB.2(MTH2) PCB.3(MTH3) PCB.4(MTH4) PCB.5(MTH5) PCB.6(MTH6)

### Notes on the sheet
- Rangel Alvarado

## Library data of the parts
BATT SOLAR = SparkFun-Connectors:M02: Header 2 Standard 2-pin 0.1" header. Use with straight break away headers (SKU : PRT-00116), right angle break away headers (PRT-00553), swiss pins (PRT-00743), machine pins (PRT-00117), and female headers (PRT-00115). Molex polarized connector foot print use with SKU : PRT-08233 with associated crimp pins and housings.
BATT_SW_NO SW_PWR = SparkFun-Electromechanical:SWITCH-SPDT: SPDT Switch Simple slide switch, Spark Fun Electronics SKU : COM-00102 DPDT SMT slide switch, AYZ0202, SWCH-08179
C1 C3 C6 = SparkFun-Capacitors:10UF-16V-10%(TANT): CAP-00811 1206/EIA-3216 Tantalum capacitor; PROD_ID: CAP-00811
C2 C4 C5 C19 = SparkFun-Capacitors:1UF-25V-10%(0805): CAP-08064; PROD_ID: CAP-08064; VALUE: 1uF
C7-C10 = SparkFun-Capacitors:.1UF-CER: .1uF ceramic SMT CAP-00810- 25V +80%/-20% (0603) CAP-08390- 100V 10% (0603) CAP-08604- 25V 5% (0603); PROD_ID: CAP-00810
C11-C16 C21-C24 = SparkFun-Capacitors:CAP: Capacitor Standard 0603 ceramic capacitor, and 0.1" leaded capacitor.
C17 C18 = SparkFun-Capacitors:1UF-25V-10%(0805): CAP-08064; PROD_ID: CAP-08064
C20 = SparkFun-Capacitors:.1UF-CER: .1uF ceramic SMT CAP-00810- 25V +80%/-20% (0603) CAP-08390- 100V 10% (0603) CAP-08604- 25V 5% (0603); PROD_ID: CAP-00810; VALUE: 0.1uF
CC_TEXT1-CC_TEXT5 = SparkFun-Aesthetics:CREATIVE_COMMONS: Creative Commons License summary
CHAIN-IN CHAIN_OUT JP4 = SparkFun-Connectors:M03: Header 3 Standard 3-pin 0.1" header. Use with straight break away headers (SKU : PRT-00116), right angle break away headers (PRT-00553), swiss pins (PRT-00743), machine pins (PRT-00117), and female headers (PRT-00115). Molex polarized connector foot print use with SKU : PRT-08232 with associated crimp pins and housings.
CHAIN-OUT CHAIN_IN = con-wago-500:W237-103: WAGO SCREW CLAMP; MPN: 237-103; OC_FARNELL: unknown; OC_NEWARK: 18M7116
CHG = SparkFun-LED:LED-RED: Assorted Red LEDs LilyPad 1206- DIO-09912 1206- DIO-00809 0603- DIO-00819; PROD_ID: DIO-00809
D1 D3-D6 D9 D13 D14 = SparkFun-DiscreteSemi:MBRA140: 40V, 1A Schottky rectifier SMA/DO-214AC package DIO-08053; PROD_ID: DIO-08053
DB9_MALE_CONN = con-subd:F09: SUB-D; OC_FARNELL: unknown; OC_NEWARK: unknown
F1-F5 = SparkFun-PowerIC:PTC: Resettable Fuse PTC Resettable Fuse. Spark Fun Electronics SKU : COM-08357
FERRITE_BEAD FERRITE_BEAD2 FERRITE_BEAD3 = SparkFun-Passives:FB
FTDI USB_IN = SparkFun-Connectors:USB-MINIB: Mini-USB "B" connector with 5th pin broken out. Created new symbol breaking out 5th "ID" pin in mini/micro USB connector spec. See: http://en.wikipedia.org/wiki/Mini_usb#Cables. Uses same footprint as 4-pin symbol. Also added pins to connect to mounting / shield pads if required (probably not generally needed as signals aren't shielded once they leave the connector).
IR_BAUD_SEL = SparkFun-Electromechanical:SW_DIP-2: DIP SWITCH
J1 = SparkFun-Connectors:POWER_JACK: Power Jack This is the standard 5.5mm barrel jack for power. The PTH is the most common, proven, reliable, footprint. The Slot footprint only works if the mill layer is transmitted to the PCB fab house so be warned. Spark Fun Electronics SKU : PRT-00119 SMT: CONN-08106 Mating wall wart : TOL-00298 (and others); PROD_ID: CONN-08106
L1 = SparkFun-Passives:INDUCTOR: Inductors Basic Inductor/Choke - 0603 and 1206. Footprints are not proven and vary greatly between part numbers.
PCB = SEL-FiSH:VM-24
PWR RTS RXD TXD USB_DN USB_PWR = SparkFun-LED:LED: LEDs Standard schematic elements and footprints for 5mm, 3mm, 1206, and 0603 sized LEDs. 5mm - Spark Fun Electronics SKU : COM-00529 (and others)
Q1 = SparkFun-DiscreteSemi:TRANSISTOR_NPN: Generic NPN BJT. MMBT2222 is the common NPN we use. Double check against datasheet- not all devices are the same!
Q2 = SparkFun-DiscreteSemi:MOSFET-NCHANNEL: Common NMOSFET Parts MFG P/N Store ID Prod ID FDD8780 TRANS-09984 SI7820DN TRANS-11055 FDS6630A IC-08089 2N7002PW TRANS-11151 FQP30N06L COM-10213 TRANS-10060 BSS123LT1G TRANS-08345 BSS138 TRANS-00830 BS170 2N7000; PROD_ID: TRANS-11151
R1-R6 R9-R19 = SparkFun-Passives:RESISTOR: Resistor Basic schematic elements and footprints for 0603, 1206, and PTH resistors.
R7 R8 R20 R21 = SparkFun-Resistors:RESISTOR: Resistor Basic schematic elements and footprints for 0603, 1206, and PTH resistors.
RJ45_IN RJ45_OUT = con-tycoelectronics:RJ45*2: RJ45 Low Profile Shield Type 2 For all RJ45 L, LC, LCT and X Series Models Source: www.tycoelectronics.com .. ENG_DS_1654001_1099_RJ_L_0507.pdf; MF: TYCO ELECTRONICS; MPN: RJ45-8L2-S; OC_FARNELL: unknown; OC_NEWARK: 52K4446
RSSI = SparkFun-LED:LED-GREEN: Various green LEDs 0603- DIO-00821 LARGE- DIO-00862 LILYPAD- DIO-09910; PROD_ID: DIO-00821
S2 = SparkFun-Electromechanical:SWITCH-MOMENTARY-2: Various NO switches- pushbuttons, reed, etc
U1 = SEL-FiSH:TPS62220
U2 U5 = SEL-FiSH:NCP380
U3 = SEL-FiSH:BQ24202
U4 = SparkFun-PowerIC:V_REG_LDO: Voltage Regulator LDO Standard 150mA LDO voltage regulator in SOT-23 layout. Micrel part MIC5205. BP (by-pass) pin is used to lower output noise with 470pF cap.
U6 = SparkFun-DigitalIC:FT232RL: USB UART FT232RL 4th Generation USB UART (USB <-> Serial) Controller. Spark Fun Electronics SKU : COM-00650 Production SKU IC-00870; PROD_ID: IC-00870
U7 = SparkFun-RF:XBEE-1: Xbee module footprints SMT header is CONN-09042.; PROD_ID: CONN-09042
U8 = SparkFun-DigitalIC:MAX232: RS232 Transceiver Very common IC. This is generically called 'MAX232', but works with the 3V equivalent MAX3232 generic ICs. Field tested and mother approved. Spark Fun Electronics SKU : COM-00316 (DIP) and COM-00589 (SMD)
U9 = SEL-FiSH:MCP2155
U10 = SparkFun-DigitalIC:RS485: RS485 transceiver
U11 = SEL-FiSH:TFBS4711-TRX
U$1 = SEL-FiSH:DAQSYS
U$7 = SparkFun-Electromechanical:LIPO-OUTLINE: Outlines for common LiPo batteries sold by SparkFun. For fit only- no pads or connectors!
USB_OUT = SparkFun-Connectors:USB: USB Connectors USB-B-PTH is fully proven SKU : PRT-00139/CONN-08278 USB-miniB is fully proven SKU : PRT-00587 USB-A-PCB is untested. USB-A-H is throughly reviewed, but untested. Spark Fun Electronics SKU : PRT-00437 USB-B-SMT is throughly reviewed, but untested. Needs silkscreen touching up. USB-A-S has not been used/tested USB-MB-H has not been used/tested USB-MICROB has been used. CONN-09505
XV_LT XV_RT = SparkFun-Connectors:M11: Header 11 Standard 11-pin 0.1" header. Use with straight break away headers (SKU : PRT-00116), right angle break away headers (PRT-00553), swiss pins (PRT-00743), machine pins (PRT-00117), and female headers (PRT-00115).
Y1 = SparkFun-FreqCtrl:CRYSTAL: Various standard crystals. Proven footprints. Spark Fun Electronics SKU : COM-00534

## Board
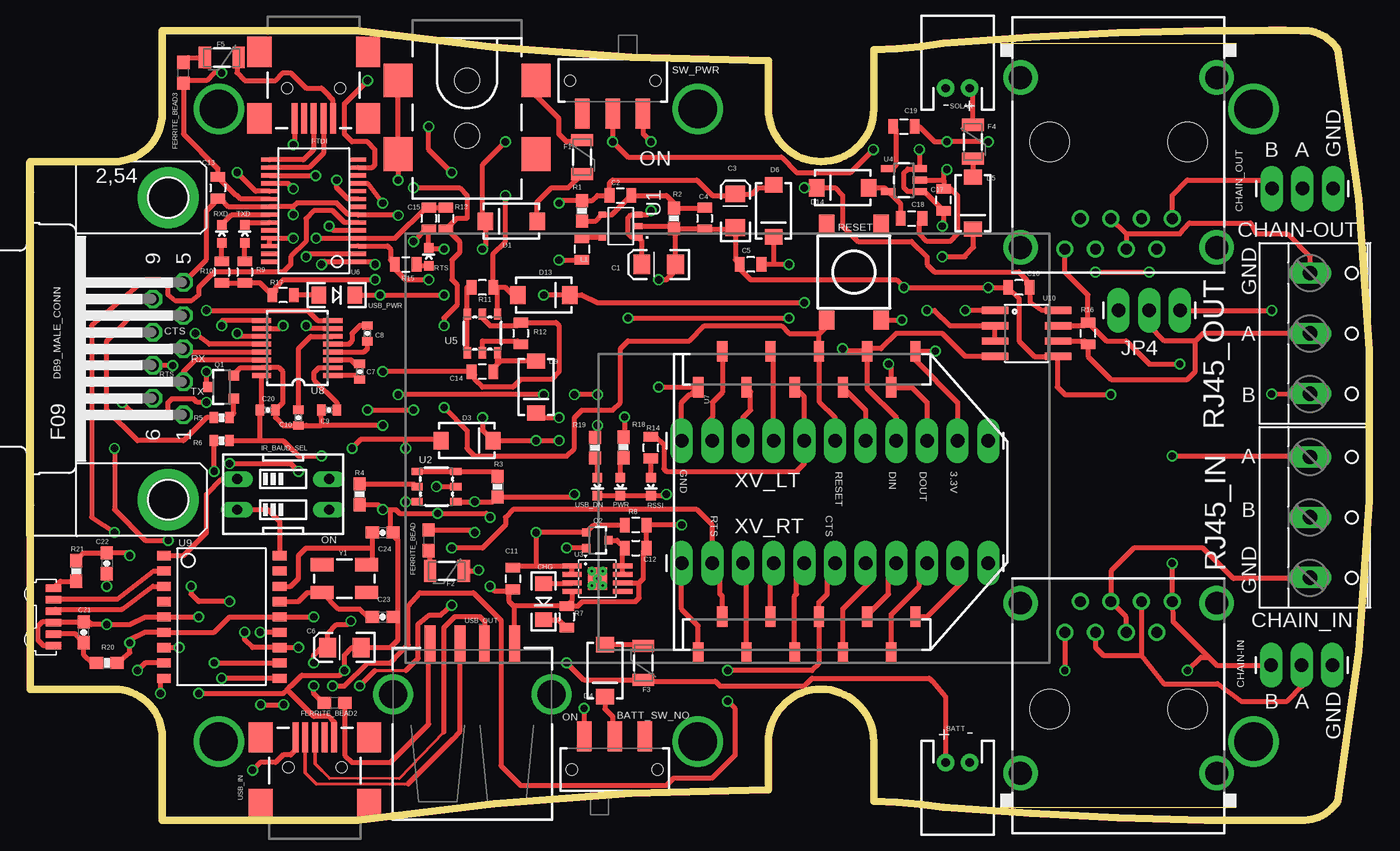
[diagram p5: board, top side]
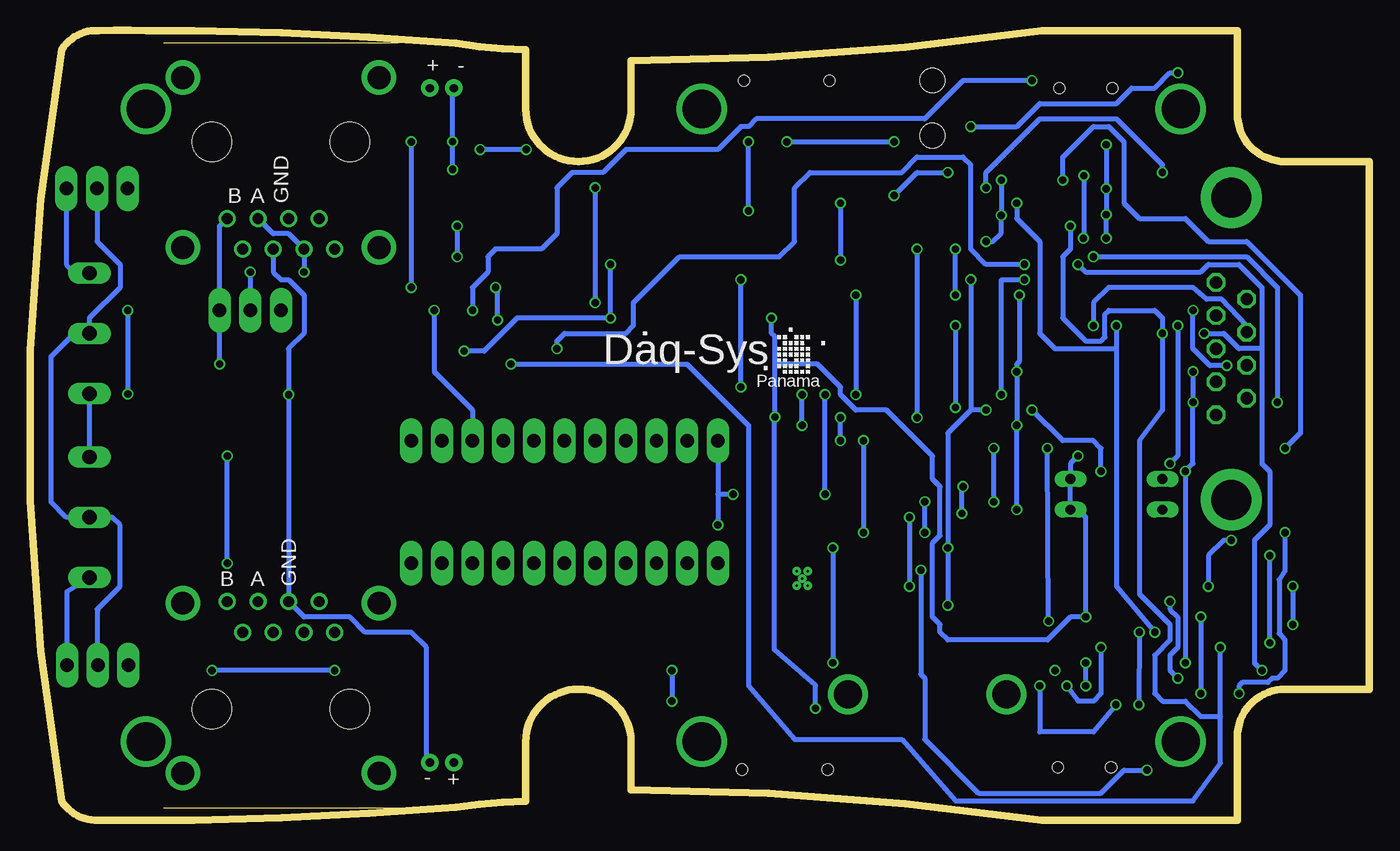
[diagram p6: board, bottom side, seen from below]

Size 110.95 x 65.49 mm. Coordinates in mm from the lower left corner, seen from the top.
Copper layers (1*16): Top 0.035mm / dielectric 1.5mm / Bottom 0.035mm
Design rules: minimum track width 6mil, minimum drill 12mil, track to track 6mil, track to pad 6mil, pad to pad 6mil, via to via 6mil, smd to smd 0mil, copper to edge 10mil, drill to drill 10mil, minimum pad ring 10mil, minimum via ring 6mil, stop-mask expansion 2mil, vias tented up to drill 100mil, thermal gap 10mil

### Footprints (pad centres in the part's own frame; a part is rotated, then mirrored left to right if it is on the bottom)
JST-2-PTH = drill 0.7 pad 1.448: 1 -1,0; 2 1,0
SWITCH-SPDT-SMD = smd 1.2 x 2.5: 1 -2.5,-2.75; 2 0,-2.75; 3 2.5,-2.75 | hole 0.9: -3.55,0; 3.55,0
EIA3216 = smd 1.4 x 1.6: A 1.4,0; C -1.4,0
0805 = smd 0.8 x 1.2: 1 -0.9,0; 2 0.9,0
0402-CAP = smd 0.7 x 0.9: 1 -0.65,0; 2 0.65,0
0603-CAP = smd 1.1 x 1: 1 -0.85,0; 2 0.85,0
1X03_LONGPADS = drill 1.118 pad 1.88 long: 1 0,0; 2 2.54,0; 3 5.08,0
W237-103 = drill 1.194 long: 1 -5,-1.29; 2 0,-1.29; 3 5,-1.29
LED-1206 = smd 1.2 x 1.4: A -1.5,0; C 1.5,0
SMA-DIODE = smd 1.27 x 1.47: A -2.15,0; C 2.15,0
F09HP = drill 1.016 octagon: 1 -5.486,-1.27; 2 -2.743,-1.27; 3 0,-1.27; 4 2.743,-1.27; 5 5.486,-1.27; 6 -4.115,1.27; 7 -1.372,1.27; 8 1.372,1.27; 9 4.115,1.27 | drill 3.302 pad 5.08: G1 -12.522,0; G2 12.522,0
PTC-1206 = smd 1 x 1.8: 1 -1.4,0; 2 1.4,0
0603 = smd 1.1 x 1: 1 -0.85,0; 2 0.85,0
USB-MINIB = smd 2.5 x 0.5: D+ 2.5,0; D- 2.5,0.8; GND 2.5,-1.6; ID 2.5,-0.8; VBUS 2.5,1.6 | smd 2.5 x 2: MTN1 -3,4.5; MTN2 2.5,4.5; MTN3 -3,-4.5; MTN4 2.5,-4.5 | hole 0.9: 0,2.2; 0,-2.2
DIPSWITCH-02 = drill 0.813 long: 1 -1.27,-3.81; 2 1.27,-3.81; 3 1.27,3.81; 4 -1.27,3.81
POWER_JACK_SMD = smd 2.8 x 2.4: GND 0,-5.7; P$4 6.1,-5.7; VIN0 0,5.7; VIN1 6.1,5.7 | hole 2.032: 0,0; 4.572,0
VM-24 = drill 3.175 pad 3.429: 1 -15.621,26.213; 2 -15.621,-26.213; 3 -55.296,26.213; 4 -55.296,-26.213; 5 -101.346,26.213; 6 -101.346,-26.213
LED-0603 = smd 0.8 x 0.8: A 0,-0.75; C 0,0.75
SOT23-3 = smd 0.8 x 0.9: 1 -0.95,-1; 2 0.95,-1; 3 0,1.1
SOT323 = smd 0.7 x 0.7: 1 -0.65,-0.925; 2 0.65,-0.925; 3 0,0.925
0603-RES = smd 1.1 x 1: 1 -0.85,0; 2 0.85,0
0402-RES = smd 0.7 x 0.9: 1 -0.65,0; 2 0.65,0
RJ45-SHIELD2 = drill 0.9 pad 1.4: 1 -4.445,6.35; 2 -3.175,8.89; 3 -1.905,6.35; 4 -0.635,8.89; 5 0.635,6.35; 6 1.905,8.89; 7 3.175,6.35; 8 4.445,8.89 | drill 1.9 pad 2.5: S1 -8.128,-5.33; S2 8.128,-5.33; S3 -8.128,8.76; S4 8.128,8.76 | hole 3.251: -5.715,0; 5.715,0
TACTILE_SWITCH_TALL = smd 1.55 x 1.3: A1 -3.975,-2.25; A2 3.975,-2.25; B1 -3.975,2.25; B2 3.975,2.25
TSOT-23-5 = smd 0.5 x 0.65: 1 0.95,1.5; 2 0,1.5; 3 -0.95,1.5; 4 -0.95,-1.5; 5 0.95,-1.5
TSOP6 = smd 0.6 x 0.95: 1 -1.25,-1.6; 2 0,-1.6; 3 1.25,-1.6; 4 1.25,1.6; 5 0,1.6; 6 -1.25,1.6
MSOP-8 = smd 0.4 x 1.6: 1 -1.05,-2.1; 2 -0.35,-2.1; 3 0.35,-2.1; 4 1.05,-2.1; 5 1.05,2.1; 6 0.35,2.1; 7 -0.35,2.1; 8 -1.05,2.1 | smd 1.89 x 1.57: P$9 0,0 | drill 0.2 pad 0.254: P$10 0.6,0.45; P$11 0,0; P$12 0.6,-0.45; P$13 -0.6,-0.45; P$14 -0.6,0.45
SOT23-5 = smd 0.55 x 1.2: 1 -0.95,-1.3; 2 0,-1.3; 3 0.95,-1.3; 4 0.95,1.3; 5 -0.95,1.3
SSOP28DB = smd 0.348 x 1.397: 1 -4.225,-3.656; 2 -3.575,-3.656; 3 -2.925,-3.656; 4 -2.275,-3.656; 5 -1.625,-3.656; 6 -0.975,-3.656; 7 -0.325,-3.656; 8 0.325,-3.656; 9 0.975,-3.656; 10 1.625,-3.656; 11 2.275,-3.656; 12 2.925,-3.656; 13 3.575,-3.656; 14 4.225,-3.656; 15 4.225,3.656; 16 3.575,3.656; 17 2.925,3.656; 18 2.275,3.656; 19 1.625,3.656; 20 0.975,3.656; 21 0.325,3.656; 22 -0.325,3.656; 23 -0.975,3.656; 24 -1.625,3.656; 25 -2.275,3.656; 26 -2.925,3.656; 27 -3.575,3.656; 28 -4.225,3.656
XBEE-SMD = smd 1.7 x 0.85: 1 -12.5,20; 2 -9.5,18; 3 -12.5,16; 4 -9.5,14; 5 -12.5,12; 6 -9.5,10; 7 -12.5,8; 8 -9.5,6; 9 -12.5,4; 10 -9.5,2; 11 12.5,2; 12 9.5,4; 13 12.5,6; 14 9.5,8; 15 12.5,10; 16 9.5,12; 17 12.5,14; 18 9.5,16; 19 12.5,18; 20 9.5,20
TSSOP16 = smd 0.4 x 1.6: 1 -2.225,-2.85; 2 -1.575,-2.85; 3 -0.925,-2.85; 4 -0.275,-2.85; 5 0.375,-2.85; 6 1.025,-2.85; 7 1.675,-2.85; 8 2.325,-2.85; 9 2.325,3.05; 10 1.675,3.05; 11 1.025,3.05; 12 0.375,3.05; 13 -0.275,3.05; 14 -0.925,3.05; 15 -1.575,3.05; 16 -2.225,3.05
SOIC18-W = smd 0.762 x 1.143: 1 -5.08,-4.788; 2 -3.81,-4.788; 3 -2.54,-4.788; 4 -1.27,-4.788; 5 0,-4.788; 6 1.27,-4.788; 7 2.54,-4.788; 8 3.81,-4.788; 9 5.08,-4.788; 10 5.08,4.788; 11 3.81,4.788; 12 2.54,4.788; 13 1.27,4.788; 14 0,4.788; 15 -1.27,4.788; 16 -2.54,4.788; 17 -3.81,4.788; 18 -5.08,4.788
SO08 = smd 0.61 x 2.21: 1 -1.905,-2.616; 2 -0.635,-2.616; 3 0.635,-2.616; 4 1.905,-2.616; 5 1.905,2.616; 6 0.635,2.616; 7 -0.635,2.616; 8 -1.905,2.616
SMD-6 = smd 0.64 x 1.27: 1 -2.38,0.02; 2 -1.43,0.02; 3 -0.48,0.02; 4 0.47,0.02; 5 1.42,0.02; 6 2.37,0.02
USB-A-S-SILK-FEMALE = smd 3 x 0.9: D+ 7.212,-1; D- 7.212,1; GND 7.212,-3.5; VBUS 7.212,3.5 | drill 2.311: P$5 3,-6.566; P$6 3,6.566
1X11_LONGPADS = drill 1.118 pad 1.88 long: 1 0,0; 2 2.54,0; 3 5.08,0; 4 7.62,0; 5 10.16,0; 6 12.7,0; 7 15.24,0; 8 17.78,0; 9 20.32,0; 10 22.86,0; 11 25.4,0
CRYSTAL-SMD-5X3 = smd 1.9 x 1.1: 1 -1.85,-1.15; 2 1.85,-1.15; 3 1.85,1.15; 4 -1.85,1.15

### Placement (x,y rotation side)
BATT  76.83,4.81 180 top
BATT_SW_NO  48.42,4.22 180 top
C1  52.07,46.08 180 top
C2  48.9,51.8 0 top
C3  58.42,50.53 90 top
C4  55.88,49.89 270 top
C5  59.69,46.08 180 top
C6  26.04,14.33 180 top
C7  27.3,37.19 90 top
C8  27.94,40.37 90 top
C9  24.77,34.02 180 top
C10  22.23,33.38 270 top
C11  40.01,20.05 270 top
C12  50.16,22.59 0 top
C13  15.54,52.43 270 top
C14  37.47,37.19 180 top
C15  33.02,49.89 270 top
C16  81.92,44.18 180 top
C17  75.68,51.43 90 top
C18  73.03,49.89 0 top
C19  72.39,57.51 0 top
C20  19.68,34.02 0 top
C21  4.45,15.6 90 top
C22  6.35,21.32 270 top
C23  29.21,16.87 0 top
C24  29.21,23.86 0 top
CC_TEXT1  14.61,-9.16 0 top  (outside the outline)
CC_TEXT2  14.61,-18.05 0 top  (outside the outline)
CC_TEXT3  14.61,-26.94 0 top  (outside the outline)
CC_TEXT4  14.61,-35.83 0 top  (outside the outline)
CC_TEXT5  14.61,-44.72 0 top  (outside the outline)
CHAIN-IN  102.81,12.87 0 top
CHAIN-OUT  107.31,40.37 270 top
CHAIN_IN  107.31,25.13 270 top
CHAIN_OUT  102.87,52.37 0 top
CHG  42.55,18.14 270 top
D1  39.86,49.65 180 top
D3  36.2,31.48 0 top
D4  47.62,12.43 270 top
D5  78.11,51.16 270 top
D6  61.59,50.53 270 top
D9  41.91,35.92 270 top
D13  42.55,43.54 0 top
D14  67.31,52.43 180 top
DB9_MALE_CONN  11.43,39.1 90 top
F1  45.72,54.97 270 top
F2  34.52,20.68 180 top
F3  50.8,13.06 90 top
F4  78.11,56.24 270 top
F5  15.88,63.23 180 top
FERRITE_BEAD  33.02,23.22 270 top
FERRITE_BEAD2  25.21,9.75 180 top
FERRITE_BEAD3  12.7,61.96 90 top
FTDI  23.5,60.69 270 top
IR_BAUD_SEL  20.95,27.03 270 top
J1  36.2,61.32 270 top
JP4  95.25,42.27 180 top
L1  45.72,47.35 270 top
PCB  0,32.75 180 top
PWR  48.9,27.67 180 top
Q1  15.88,35.92 90 top
Q2  46.99,23.22 270 top
R1  45.72,50.53 90 top
R2  53.34,49.89 90 top
R3  38.73,27.67 270 top
R4  27.3,27.03 90 top
R5  15.88,33.38 180 top
R6  15.88,31.48 180 top
R7  44.45,16.87 270 top
R8  50.16,24.49 180 top
R9  17.78,45.45 270 top
R10  15.88,45.45 270 top
R11  37.47,44.18 180 top
R12  40.64,40.37 270 top
R13  34.44,49.89 270 top
R14  51.44,30.9 90 top
R15  31.11,46.08 0 top
R16  87.63,40.37 90 top
R17  20.95,43.54 180 top
R18  49.16,30.92 90 top
R19  46.8,30.89 90 top
R20  6.35,13.06 0 top
R21  3.81,20.68 270 top
RJ45_IN  90.17,9.25 0 top
RJ45_OUT  90.17,56.24 180 top
RSSI  51.44,27.67 180 top
RTS  33.02,46.72 0 top
RXD  15.88,48.62 0 top
S2  68.25,45.45 270 top
SOLAR  76.83,60.69 0 top
SW_PWR  48.26,61.32 0 top
TXD  17.78,48.62 0 top
U1  48.9,49.26 270 top
U2  33.66,27.67 90 top
U3  46.99,20.05 270 top
U4  72.39,53.07 90 top
U5  37.47,40.37 180 top
U6  23.5,50.53 90 top
U7  53.34,26.4 270 top
U8  22.23,39.1 90 top
U9  15.88,16.87 270 top
U10  82.55,40.37 270 top
U11  1.91,16.87 270 top
U$1  63.5,37.83 0 bottom
U$7  84.45,13.06 90 top
USB_DN  46.99,27.67 180 top
USB_IN  23.59,4.4 90 top
USB_OUT  36.63,7.45 90 top
USB_PWR  25.4,43.54 0 top
XV_LT  53.98,31.48 0 top
XV_RT  53.98,21.32 0 top
Y1  26.04,20.05 180 top

### Tracks (layer width: path | path; a pad name or v marks a point on that pad's centre or on a via)
3.3V  (via drill 0.6)
  Top 0.406: XV_LT.10 76.83,34.65 73.34,38.15 U7.1 v75,38.9 | R21.1 4.45,22.17 C22.1 8.04,22.17 v8.26,21.95 | R20.2 8.25,13.92 v8.25,14.73 8.25,14.96 9.53,15.6 U9.6 15.24,15.6 16.51,16.87 U9.14 v23.5,16.87 | U8.16 19.18,34.16 C20.1 19.05,34 19.05,31.48 | 60.96,46.08 C5.1 61.59,46.08 | BATT_SW_NO.3 45.92,8.66 v45.88,9.3 | v49.25,33.45 49.25,31.86 R18.2 | v49.53,41.64 v62.87,41.64 | v62.87,46.08 61.59,46.08 | R6.1 19.05,31.48 | 19.05,31.48 20.95,31.48 22.23,30.21 v24.13,30.21 | D6.C 61.59,46.08
  Bottom 0.406: v8.25,14.73 v8.26,21.95 | v24.13,30.21 24.77,29.57 IR_BAUD_SEL.4 IR_BAUD_SEL.3 24.13,25.76 23.5,25.13 v23.5,16.87 24.77,16.87 26.67,14.97 34.92,14.97 35.56,15.6 35.56,16.24 36.2,16.87 36.2,22.99 35.56,23.62 35.56,27.67 36.2,28.3 36.2,30.21 40.01,34.02 42.55,34.02 43.81,35.29 43.81,35.92 45.72,37.83 49.25,37.83 | v45.88,9.3 45.88,11.18 49.3,14.15 49.3,33.4 v49.25,33.45 49.25,37.83 | 49.25,37.83 49.25,40.09 49.53,40.37 v49.53,41.64 | v62.87,46.08 v62.87,41.64 70.6,41.64 U7.1 v75,38.9 74.93,38.9 74.93,39.1
3V3OUT  (via drill 0.6)
  Top 0.406: U6.17 v23.64,53.45 | v23.7,48.25 U6.4 30.25,48.25 32.8,50.79 C15.1 R13.1
  Bottom 0.406: v23.64,53.45 23.64,48.3 v23.7,48.25
5V  (via drill 0.6)
  Top 0.406: U5.1 38.73,41.97 38.73,44.18 R11.1 | D13.A 40.01,43.54 39.37,44.18 R11.1 | U6.20 17.44,51.5 17.14,51.8 17.07,51.8 C13.1 15.54,54.04 12.7,56.88 FERRITE_BEAD3.1 12.91,61.32 14.61,61.32 15.24,61.96 v15.88,61.96 | R11.1 38.37,46.98 39.37,47.99 v39.37,51.8 | v34.92,53.7 33.02,55.61 v33.02,57.51
  Bottom 0.406: v39.37,51.8 37.47,53.7 v34.92,53.7 | v33.02,57.51 29.21,57.51 27.3,59.42 20.95,59.42 19.68,60.69 17.78,60.69 16.51,61.96 v15.88,61.96
A  (via drill 0.6)
  Top 0.406: U10.6 87.36,39.73 R16.1 87.63,38.46 89.53,36.56 95.89,36.56 96.52,37.19 96.52,39.73 | CHAIN-OUT.2 97.16,40.37 96.52,39.73 | 96.52,39.73 93.98,39.73 92.71,41 JP4.2 | RJ45_IN.6 92.08,13.7 | 92.08,13.7 93.93,11.34 98.38,11.34 100.33,9.89 104.14,9.89 105.41,11.16 105.41,12.81 CHAIN-IN.2 | v88.27,45.45 v92.71,45.45 | RJ45_IN.3 88.27,14.33 88.9,13.7 92.08,13.7
  Bottom 0.406: CHAIN-IN.2 105.35,17.44 105.41,17.51 103.5,19.41 103.5,24.49 104.14,25.13 CHAIN_IN.2 107.95,25.13 109.22,26.4 109.22,38.46 107.31,40.37 CHAIN-OUT.2 106.05,40.39 106.05,41.64 103.5,44.18 103.5,46.08 105.41,47.99 CHAIN_OUT.2 | v88.27,45.45 RJ45_OUT.6 89.53,48.62 90.81,48.62 RJ45_OUT.3 | v92.71,45.45 JP4.2
B  (via drill 0.6)
  Top 0.406: U10.7 87.36,41 R16.2 | 97.63,13.54 94.68,16.49 RJ45_IN.8 v94.61,21.32 | 97.63,13.54 98.3,12.87 CHAIN-IN.1 | JP4.1 v102.87,42.27 | v102.85,35.35 CHAIN-OUT.3 | v94.61,30.21 105.94,30.21 CHAIN_IN.1 | RJ45_OUT.1 94.61,51.8 95.89,53.07 102.17,53.07 CHAIN_OUT.1 | R16.2 89.17,39.73 90.81,39.73 92.71,37.83 v95.25,37.83 | R16.2 87.63,43.54 85.72,45.45 RJ45_OUT.8 | RJ45_IN.1 v85.72,12.43 | v95.89,12.43 97,13.54 97.63,13.54
  Bottom 0.406: v102.87,42.27 v102.85,35.35 | CHAIN_IN.1 CHAIN-OUT.3 | v94.61,21.32 v94.61,30.21 | RJ45_OUT.1 95.25,49.26 JP4.1 v95.25,37.83 | v85.72,12.43 v95.89,12.43
BAUD0
  Top 0.406: U9.1 12.7,21.95 14.61,23.86 14.61,27.03 15.88,28.3 IR_BAUD_SEL.1
BAUD1
  Top 0.406: IR_BAUD_SEL.2 19.68,25.76 20.66,24.78 U9.18
CTS  (via drill 0.6)
  Top 0.406: XV_RT.6 66.04,20.68 66.04,18.78 65.34,18.08 U7.16 65.34,13 64.77,12.43 v57.78,12.43 | v22.23,14.33 U9.12 18.41,14.33 17.78,14.97 v17.78,15.6 | v25.05,11.15 26.02,11.15 27.94,13.06 29.84,13.06 31.32,14.58 31.32,17.76 32.28,18.88 36.73,18.88 38.1,17.51 38.1,17.5 39,16.6 39,4.54 40.64,2.9 52.7,2.9 53.34,3.54 56.52,3.54 58.42,5.44 58.42,9.25 v57.78,9.89 | U8.10 20.73,40.77 v20.95,41 | U6.11 27.95,52.8 v29.21,51.16
  Bottom 0.406: v57.78,12.43 v57.78,9.89 | v22.23,14.33 22.23,10.52 22.86,9.89 24.13,9.89 24.13,9.98 v25.05,11.15 | v20.95,41 20.95,39.1 | 20.95,39.1 20.95,19.41 v17.78,15.6 | v29.21,51.16 29.21,49.89 27.3,47.99 27.3,40.37 26.04,39.1 20.95,39.1
DIN  (via drill 0.6)
  Top 0.406: U7.3 69.34,35.8 71.75,33.38 XV_LT.8 | U10.4 77.47,38.46 75.56,40.37 71.75,40.37 70.48,39.1 69.54,39.1 U7.3 | U8.12 14.87,39.47 v13.69,40.37 | U9.8 9.53,13.06 v8.89,12.43 | U7.3 67.51,38.9 v67.31,39.1 | v28.57,46.08 28.36,46.3 U6.1 24.38,46.33 v24.13,46.08
  Bottom 0.406: v24.13,46.08 23.5,45.45 13.97,45.45 13.34,46.08 10.79,46.08 8.89,44.18 8.89,39.1 | v13.69,40.37 12.06,40.37 10.79,39.1 8.89,39.1 | v8.89,12.43 9.53,13.06 9.53,23.22 8.26,24.49 8.26,28.94 8.89,29.57 8.89,39.1 | v67.31,39.1 67.31,39.73 66.67,40.37 61.59,40.37 60.96,41 60.96,42.91 57.15,46.72 48.9,46.72 47.62,47.99 47.62,52.43 46.35,53.7 38.73,53.7 37.47,54.97 33.66,54.97 33.02,54.34 33.02,47.35 31.75,46.08 v28.57,46.08
DM
  Top 0.254: 23.7,3.04 31.32,3.04
  Top 0.305: USB_IN.D- 22.8,3.94 23.7,3.04
  Top 0.406: USB_OUT.D- 35.56,14.59 35.56,7.35 34.99,6.71 31.32,3.04
DOUT  (via drill 0.6)
  Top 0.406: XV_LT.9 74.3,34.65 73.05,35.9 U7.2 71.34,37.61 v71.12,37.83 | U10.1 v77.47,42.27 | U8.11 17.39,40.12 v17.14,40.37 | U9.7 v12.35,14.33 | U6.5 25.12,48.9 v24.77,49.26
  Bottom 0.406: v77.47,42.27 77.47,37.19 74.3,34.02 XV_LT.9 | 70.48,37.83 v71.12,37.83 56.52,37.83 51.44,32.75 51.44,11.16 47.62,6.71 38.73,6.71 34.29,1.63 14.61,1.63 12.35,4.76 12.35,8.62 | 12.35,8.62 v12.35,14.33 | v24.77,49.26 24.77,47.35 25.4,46.72 25.4,41.64 23.5,39.73 22.21,39.73 21.9,40.05 21.9,41.96 21.59,42.27 17.78,42.27 17.14,41.64 v17.14,40.37 17.14,34.02 19.05,31.48 19.05,18.78 16.51,16.24 16.51,14.97 17.78,13.7 17.78,10.52 17.14,9.89 15.24,9.89 13.97,8.62 12.35,8.62
DP
  Top 0.203: 24.8,3.5 30.59,3.5
  Top 0.254: 24.13,4.17 24.8,3.5 | 30.59,3.5 34.29,7.35
  Top 0.305: USB_IN.D+ 23.59,4.71 24.13,4.17
  Top 0.406: 34.29,7.35 34.29,15.99 35.2,16.9 37.25,16.9 37.65,16.5 37.65,14.68 USB_OUT.D+
DSR  (via drill 0.6)
  Top 0.406: U6.9 26.33,51.5 25.4,52.43 v25.4,53.07 | v6.99,30.84 6.99,25.76 9.53,23.22 v11.43,23.22 | v13.34,19.41 13.34,18.78 13.97,18.14 v16.51,18.14 | U9.10 v15.88,11.79
  Bottom 0.406: v25.4,53.07 25.4,54.97 22.86,57.51 21.59,57.51 20.32,56.24 20.32,51.16 19.05,49.89 15.24,49.89 13.34,47.99 10.16,47.99 5.71,43.54 5.71,32.11 v6.99,30.84 | v11.43,23.22 12.06,23.22 13.34,21.95 v13.34,19.41 | v16.51,18.14 16.51,17.51 15.88,16.87 15.88,14.33 16.51,13.7 16.51,12.43 v15.88,11.79
DTR  (via drill 0.6)
  Top 0.406: Q1.3 14.61,36.09 v14.61,37.19 | 15.13,31.48 R6.2 15.24,31.46 v15.24,28.94 | v15.24,13.06 U9.11 | U6.2 23.1,46.95 v22.86,46.72 | v7.62,34.65 8.89,33.38 10.79,33.38 11.43,34.02 11.43,34.65 11.72,34.95 13.55,34.95 13.85,34.65 v14.61,34.65
  Bottom 0.406: v14.61,37.19 v14.61,34.65 14.61,29.57 v15.24,28.94 v15.24,13.06 | v22.86,46.72 10.16,46.72 7.62,44.18 v7.62,34.65
FTDI
  Top 0.406: FTDI.D+ 23.5,55.61 22.64,54.75 U6.15
GND  (via drill 0.6)
  Top 0.406: XV_LT.1 53.98,34.65 54.61,35.29 54.73,35.29 U7.10 52.07,35.9 v52.07,35.92 | R7.1 40.06,17.77 | 40.06,17.77 39.7,18.14 39.7,18.84 C11.2 39.91,19.05 38.45,19.05 v38.1,19.4 v38.1,19.41 | J1.GND 30.5,61.94 30.48,61.96 30.48,61.34 J1.GND | R8.1 C12.2 50.8,22.32 50.8,20.05 50.45,19.7 | U3.6 50.45,19.7 | RJ45_IN.5 90.81,16.87 RJ45_IN.4 89.53,20.68 91.44,22.59 97.16,22.59 99.69,20.05 105.94,20.05 CHAIN_IN.3 | 90.81,48.62 95.25,48.62 96.03,49.51 101.11,49.51 101.6,48.62 104.14,48.62 106.03,46.74 CHAIN-OUT.1 | RJ45_OUT.5 90.81,48.62 | 90.81,48.62 RJ45_OUT.4 | v89.53,35.29 85.72,35.29 85.09,35.92 85.09,38.39 U10.5 83.19,38.46 81.92,39.73 81.92,43.28 C16.2 v79.38,44.18 v72.39,44.18 71.75,44.81 59.69,44.81 58.79,45.71 C5.2 58.42,46.45 C3.C 58.28,48.99 C4.2 55.83,49.04 R2.1 | 50.45,19.7 50.45,18.43 50.16,18.14 45.74,18.14 45.38,17.77 R7.1 | R8.1 51.05,24.51 | v53.98,24.49 R8.1 | U11.6 1.1,14.5 0.64,14.97 0.64,16.08 1,16.45 1.88,16.45 U11.4 1.98,16.45 C21.2 4.87,16.45 5.08,16.24 v6.35,16.24 8.26,16.24 9.53,16.87 U9.5 v13.97,16.87 | C22.2 v6.35,19.41 | 24.13,32.75 22.88,32.75 C10.2 20.97,32.73 20.32,33.38 20.32,34 C20.2 20.95,34.64 20.95,37.19 20.62,37.52 U8.15 19.15,37.5 17.4,37.5 16.88,36.97 Q1.2 | 24.13,32.75 24.11,34 C9.2 | v29.21,32.75 24.13,32.75 | U6.26 U6.25 v21.8,48.25 | v21.8,50.21 21.8,50.85 | 21.8,50.85 U6.21 16.45,50.85 15.77,51.53 C13.2 15.54,51.46 14.61,50.53 14.61,46.49 DB9_MALE_CONN.5 | U6.18 21.35,52.8 v21.8,52.35 | 29.84,25.76 v29.21,25.76 28.79,26.18 R4.1 | 29.84,25.76 30.29,25.76 30.6,25.45 v33.75,25.45 37.78,25.45 v38.1,25.13 | v33.66,27.67 U2.2
  Top 0.406: U5.2 37.47,41.64 38.1,41 40.38,41 R12.1 43.55,41.27 43.81,41 43.81,37.19 43.18,36.56 40.64,36.56 40.01,35.92 37.47,35.92 36.83,36.56 36.83,36.93 C14.2 v29.21,37.19 | 29.84,25.76 29.84,24.07 C24.2 30.06,23.64 30.48,23.22 30.48,16.45 C23.2 30.48,16.66 30.48,14.97 29.84,14.33 C6.C 26.67,14.33 26.04,13.7 v26.04,12.43 25.66,12.05 22.5,12.05 21.61,11.16 21.59,11.16 21.27,10.84 | R2.1 53.47,48.91 C1.C 53.34,45.95 53.34,45.45 52.7,44.81 v52.07,44.81 | U1.2 53.12,49.26 R2.1 | S2.B2 v72.22,41.47 | USB_DN.C PWR.C RSSI.C 52.59,26.92 v52.7,27.03 | U4.2 75.69,53.07 | 75.69,53.07 C17.2 76.3,52.33 76.83,51.8 76.83,48.62 76.2,47.99 74.3,47.99 73.66,48.62 73.66,49.63 C18.2 | FTDI.GND 21.89,56.09 v21.8,56 | v30.48,53.07 30.5,53.08 J1.P$4 J1.GND | v30.5,50.15 27.21,50.15 U6.7 26.35,50.21 25.4,51.16 22.11,51.16 21.8,50.85 | v31.75,47.99 32.76,48.99 C15.2 RTS.C 33.13,47.35 v34.29,47.35 | v79.38,56.24 v75.95,56.24 v75.95,56.25 v75.94,56.24 74.93,56.24 73.66,57.51 C19.2 | 75.69,53.07 75.69,53.69 v75.95,53.95 | v13.97,10.52 20.95,10.52 21.27,10.84 | USB_PWR.C v29,43.54 | v29,43.54 v29,43.55 | v29,43.54 v34.29,43.54 | USB_IN.GND 25.2,8.19 24.77,8.62 23.5,8.62 21.27,10.84 | USB_OUT.GND 40.13,17.71 40.06,17.77 | U3.4 44.89,18.21 R7.1
  Bottom 0.406: CHAIN-IN.3 107.89,18.97 CHAIN_IN.3 | CHAIN_OUT.3 107.95,46.08 107.31,45.45 106.11,45.45 CHAIN-OUT.1 | RJ45_OUT.4 90.81,45.45 90.17,44.81 89.53,44.81 88.27,43.54 88.27,40.37 89.53,39.1 v89.53,35.29 RJ45_IN.4 88.27,16.87 84.45,16.87 83.19,15.6 79.38,15.6 78.11,14.33 78.11,5.08 BATT.1 | XV_LT.1 53.98,27.03 | 53.98,27.03 v53.98,24.49 | v79.38,56.24 v79.38,44.18 | v6.35,19.41 v6.35,16.24 | v29.21,25.76 v29.21,32.75 v29.21,37.19 29.21,37.83 29,38.04 v29,43.55 | v21.8,48.25 v21.8,50.21 v21.8,52.35 v21.8,56 | v33.75,25.45 33.75,27.57 v33.66,27.67 | v52.7,27.03 53.98,27.03 | v30.48,53.07 30.48,50.17 v30.5,50.15 30.5,48.7 31.21,47.99 v31.75,47.99 | v72.22,41.47 72.22,44.01 v72.39,44.18 | SOLAR.1 75.95,60.57 v75.95,56.25 v75.95,53.95 | v38.1,25.13 v38.1,19.41 | v13.97,16.87 v13.97,10.52 | v34.29,43.54 v34.29,47.35 | v52.07,35.92 v52.07,44.81
GPIO1
  Top 0.406: U7.9 57.34,35.48 56.52,34.65 56.52,33.38 55.88,32.75 55.88,32.11 XV_LT.2
GPIO2
  Top 0.406: U7.19 71.34,17.09 73.66,19.41 73.66,20.68 XV_RT.9
GPIO3
  Top 0.406: U7.18 69.34,17 71.12,18.78 71.12,20.68 XV_RT.8
GPIO4
  Top 0.406: U7.13 59.34,21.03 XV_RT.3
GPIO6
  Top 0.406: U7.15 63.34,18.62 63.5,18.78 63.5,20.68 XV_RT.5
GPIO7
  Top 0.406: XV_LT.4 61.59,38.64 U7.7
GPIO8
  Top 0.406: U7.4 69.22,34.02 XV_LT.7
GPIO9
  Top 0.406: XV_LT.3 59.05,33.38 59.69,34.02 59.69,35.55 U7.8
GPIO14
  Top 0.406: U7.11 55.34,16.14 53.98,17.51 XV_RT.1
N$1  (via drill 0.6)
  Top 0.406: F2.1 37.09,20.68 v37.15,20.75 | USB_IN.VBUS 22,5.85 21.59,5.44 20.95,5.44 20.32,4.81 19.05,4.81 v18.41,4.17
  Bottom 0.406: v37.15,20.75 37.15,12.11 36.83,11.79 36.83,6.71 32.38,2.27 22.23,2.27 20.32,4.17 v18.41,4.17
N$2
  Top 0.406: D4.C 47.62,9.25 48.26,8.62 48.26,7.14 BATT_SW_NO.2
N$3
  Top 0.406: U1.5 45.77,48.31 L1.1
N$4
  Top 0.406: F2.2 33.12,22.27 FERRITE_BEAD.2
N$5  (via drill 0.6)
  Top 0.406: D6.A 61.35,52.43 60.33,52.43 59.82,51.93 C3.A 58.29,51.8 56.52,51.8 55.24,53.07 48.26,53.07 47.99,52.8 C2.1 46.99,51.8 46.57,51.38 R1.2 44.03,51.38 v43.81,51.16 | v43.8,46.45 L1.2
  Bottom 0.406: v43.81,51.16 43.81,46.46 v43.8,46.45
N$7
  Top 0.406: F1.1 45.72,56.24 44.45,56.24 43.81,56.88 43.81,58.15 41.91,60.05 J1.VIN0
N$8
  Top 0.406: D1.A 42.01,51.26 43.18,52.43 44.58,52.43 F1.2
N$9
  Top 0.406: D4.A 50.69,14.58 F3.2
N$10
  Top 0.406: CHG.A 44.84,19.64 U3.3
N$11
  Top 0.406: R3.1 38.73,28.92 U2.3 U2.4
N$12
  Top 0.406: F4.2 D5.A
N$13
  Top 0.406: F5.1 17.14,63.1 17.14,61.96 17.78,61.32 20.32,61.32 20.95,61.96 21.59,61.96 22.86,60.69 24.13,60.69 24.77,60.05 24.77,60.03 25.05,59.75 25.05,58.23 FTDI.VBUS
N$14
  Top 0.406: C4.1 55.83,50.74 R2.2 53.34,51.16 52.7,51.8 C2.2 48.2,50.21 U1.4 46.87,49.68 R1.1
N$15
  Top 0.406: FERRITE_BEAD3.2 13.12,63.23 F5.2
N$16
  Top 0.406: R4.2 31.84,27.88 U2.5
N$17
  Top 0.406: FTDI.D- 24.3,55.3 23.11,54.1 U6.16
N$18
  Top 0.406: U8.2 25.05,37.5 23.9,37.5 23.5,37.09 23.5,36.56 25.41,34.64 C9.1
N$19
  Top 0.406: C10.1 22.23,39.1 23.25,40.12 U8.6
N$20
  Top 0.406: C8.2 27.32,41.02 26.67,40.37 26.67,39.73 26.41,39.47 U8.5
N$21
  Top 0.406: U8.3 25.1,38.2 26.55,38.2 26.91,37.84 C7.2
N$22
  Top 0.406: C7.1 26.98,36.87 U8.1
N$23
  Top 0.406: U8.4 27.66,38.82 27.94,39.1 C8.1
N$24
  Top 0.406: R5.1 16.88,33.73 Q1.1
N$25
  Top 0.406: CHG.C 43.78,16.64 R7.2
N$27
  Top 0.406: R15.2 32.13,45.97 RTS.A
N$28
  Top 0.406: RXD.C 16.7,50.2 U6.22
N$29
  Top 0.406: TXD.C 17.96,49.55 U6.23
N$30
  Top 0.406: R9.1 TXD.A
N$31
  Top 0.406: R10.1 RXD.A
N$32
  Top 0.406: C14.1 38.37,37.46 38.73,37.83 | 38.73,37.83 38.73,38.75 U5.6 | D9.A 38.98,38.07 38.73,37.83
N$33
  Top 0.406: RSSI.A R14.1
N$34
  Top 0.406: R11.2 36.2,44.18 36.2,41.97 U5.3 U5.4
N$35
  Top 0.406: PWR.A 48.9,29.8 R18.1
N$36
  Top 0.406: USB_PWR.A R17.1
N$37
  Top 0.406: U5.5 37.47,39.73 40.38,39.73 R12.2
N$38
  Top 0.406: USB_DN.A 46.99,29.86 R19.1
N$39  (via drill 0.6)
  Top 0.406: v26.67,30.84 26.67,30.87 27.4,31.6 31.11,31.6 | 31.11,31.6 33.92,31.6 D3.A | U2.6 31.14,26.42 v31.11,26.4 | v31.11,30.84 31.11,31.6 | v23.5,13.06 23.5,13.7 24.13,14.33 C6.A 24.64,15.47 25.4,16.24 26.29,16.24 v26.57,16.52 | FERRITE_BEAD2.2 24.32,9.7 23.5,10.52 v23.5,11.16
  Bottom 0.406: v26.57,16.52 v26.67,30.84 | v31.11,26.4 v31.11,30.84 | v23.5,11.16 v23.5,13.06
N$40  (via drill 0.6)
  Top 0.406: C1.A 50.67,48.03 U1.1 49.84,48.31 49.53,48.62 49.53,49.93 49.8,50.2 50.38,50.2 U1.3 51.12,50.21 v51.44,50.53 | v51.44,56.24 50.8,56.88 50.8,58.53 SW_PWR.3 50.76,58.19 50.8,58.15
  Bottom 0.406: v51.44,50.53 v51.44,56.24
N$41
  Top 0.406: U4.4 71.44,54.02 71.75,54.34 71.75,57.25 C19.1
N$42
  Top 0.406: C18.1 72.12,51.08 U4.5 70.78,52.43 D14.A
N$43
  Top 0.406: U3.7 U3.8 49.09,22.41 C12.1 48.63,23.22 Q2.3
N$44
  Top 0.406: U7.14 61.34,21.06 XV_RT.4
N$45
  Top 0.406: U11.5 3.75,15.45 C21.1 4.45,13.7 5.08,13.06 R20.1
N$46
  Top 0.406: Y1.1 28.36,21.67 28.36,22.59 | 28.36,22.59 C24.1 | U9.16 21.59,19.41 22.23,20.05 22.23,21.95 22.86,22.59 28.36,22.59
N$47
  Top 0.406: U9.15 22.23,18.14 22.98,18.9 Y1.3 25.57,17.51 27.3,17.51 27.94,16.87 C23.1
N$49
  Top 0.406: USB_OUT.VBUS 33.02,14.55 33.02,7.98 29.84,4.81 26.67,4.81 26.07,5.41 FERRITE_BEAD2.1
N$50
  Top 0.406: U11.1 2.5,19.83 R21.2
RESET  (via drill 0.6)
  Top 0.406: XV_LT.6 66.67,33.38 65.41,34.65 65.41,38.83 U7.5 65.34,40.3 | 65.34,40.3 66.04,41 66.04,41.43 S2.A2 | v34.29,41 34.29,41.64 35.35,42.7 35.35,44.4 34.94,44.81 34.92,44.81 34.95,44.84 34.95,46.45 35.56,47.06 35.56,47.99 34.55,48.99 R13.2 35.34,49.89 36.2,49.89 36.2,51.8 35.56,52.43 v31.75,52.43 | v34.29,34.22 36.2,32.3 36.2,30.84 36.83,30.21 44.45,30.21 45.09,30.84 45.09,33.38 45.72,34.02 48.26,34.02 48.9,34.65 48.9,39.1 49.53,39.73 54.61,39.73 55.88,41 62.23,41 62.87,40.37 65.28,40.37 65.34,40.3 | U6.19 18.7,52.15 v17.14,53.7
  Bottom 0.406: v34.29,41 v34.29,34.22 | v17.14,53.7 17.14,54.34 20.95,58.15 27.3,58.15 31.75,53.7 v31.75,52.43
RI  (via drill 0.6)
  Top 0.406: U6.6 26.04,49.55 25.07,50.53 23.5,50.53 22.86,49.89 22.86,47.99 21.59,46.72 21.59,46.08 20.95,45.45 15.24,45.45 13.97,44.18 13.97,43.54 13.34,43.06 12.06,43.06 11.43,43.54 11.43,44.18 10.79,44.81 9.53,44.81 5.08,41 5.08,25.13 v6.99,23.86 | v10.79,10.52 10.79,11.79 U9.9
  Bottom 0.406: v6.99,23.86 6.99,20.68 7.47,19.95 7.47,15.5 6.99,14.97 6.99,12.43 7.62,11.79 8.05,11.79 8.4,11.45 10.51,11.45 10.79,11.16 v10.79,10.52
RS232_CTS  (via drill 0.6)
  Top 0.406: U8.7 23.09,40.77 v22.86,41
  Bottom 0.406: DB9_MALE_CONN.8 10.16,41 12.21,43.21 13.48,43.21 14.61,44.18 21.59,44.18 22.86,42.91 v22.86,41
RS232_DTR
  Top 0.406: R5.2 14.61,33.38 12.7,31.48 8.89,31.48 6.35,34.02 6.35,39.73 7.62,41 8.26,41.67 8.38,41.8 12.66,41.8 DB9_MALE_CONN.4
RS232_RTS  (via drill 0.6)
  Top 0.406: DB9_MALE_CONN.7 11.62,37.72 v11.8,37.7 | v14.61,42.27 22.98,42.27 23.8,41.45 25.05,41.45 U8.8
  Bottom 0.406: v11.8,37.7 13.21,37.7 14.61,39.1 v14.61,42.27
RS232_RX
  Top 0.406: DB9_MALE_CONN.3 12.97,38.82 U8.13
RS232_TX
  Top 0.406: U8.14 19.15,38.2 13.71,38.2 12.7,37.19 DB9_MALE_CONN.2
RSSI
  Top 0.406: 63.5,36.06 U7.6 64.14,35.1 XV_LT.5 64.14,29.57 63.5,28.94 52.7,28.94 52.5,29.14 52.5,31.15 51.85,31.8 R14.2
RTS  (via drill 0.6)
  Top 0.254: 28.57,12.43 31.13,12.43
  Top 0.406: U7.12 57.34,18.59 57.15,18.78 57.15,20.68 XV_RT.2 56.52,24.49 55.24,25.76 40.01,25.76 39.37,25.13 39.37,24.49 37.47,22.59 v34.92,22.59 | R15.1 30.15,46.15 | v34.92,17.84 34.04,17.02 33.07,17.02 32.15,16.3 32.15,13.45 31.13,12.43 | U9.13 v19.05,15.6 | v19.1,9.6 v21,9.6 | U8.9 15.88,41.42 v15.88,41 | v16.51,29.57 21.59,29.57 v22.23,28.94 | v27.94,34.02 v31.75,34.02 | U6.3 29.59,47.6 29.84,47.35 29.84,46.45 R15.1 | R15.1 30.21,45.71 31.11,44.81 v33.02,44.81 | v27.3,11.16 28.57,12.43
  Bottom 0.406: v33.02,44.81 33.02,34.02 | 33.02,34.02 34.92,32.11 v34.92,22.59 v34.92,17.84 | v19.05,15.6 v19.1,9.6 | v27.3,11.16 27.3,7.35 22.86,7.35 v21,9.6 | v15.88,41 15.88,30.21 v16.51,29.57 | v22.23,28.94 22.23,30.84 22.86,31.48 25.4,31.48 v27.94,34.02 | v31.75,34.02 33.02,34.02
RXIR
  Top 0.406: U11.3 2.08,17.51 7.62,17.51 10.16,19.41 U9.3
SEN2
  Top 0.406: U7.20 74.32,16.9 77.47,20.05 77.47,20.68 XV_RT.10
SENSOR5
  Top 0.406: U7.17 67.34,17.48 67.31,17.51 69.85,20.05 69.85,20.68 XV_RT.7
SUN
  Top 0.406: F4.1 78.11,60.42 SOLAR.2
TXDEN  (via drill 0.6)
  Top 0.406: U10.3 U10.2 76.2,41 74.93,42.27 v74.3,42.27 | U6.13 28.34,54.1 28.57,54.34 28.57,55.61 27.94,56.24 26.67,56.24 26.04,56.88 26.04,59.42 v27.94,61.32
  Bottom 0.406: v27.94,61.32 33.66,61.32 36.83,58.15 50.8,58.15 51.44,57.51 52.07,57.51 53.98,55.61 61.59,55.61 63.5,53.7 66.04,53.7 67.31,52.43 67.31,48.62 68.58,47.35 72.39,47.35 73.03,46.72 73.03,45.45 74.3,44.18 v74.3,42.27
TXIR
  Top 0.406: U11.2 1.97,18.35 7.25,18.35 10.22,20.68 U9.2
V_BAT  (via drill 0.6)
  Top 0.406: BATT.2 75.83,10.25 74.75,11.54 74.5,11.79 64.77,11.79 64.14,11.16 57.15,11.16 56.77,11.54 51.38,11.54 F3.1 45.85,11.66 v44.45,13.06 | Q2.2 46.05,22.59 v44.45,22.59
  Bottom 0.406: v44.45,22.59 v44.45,13.06
V_USB_DOWN  (via drill 0.6)
  Top 0.406: FERRITE_BEAD.1 36.62,24.07 v36.83,23.86 | U2.1 v36.83,26.42 38.34,26.42 R3.2 44.87,26.82 v45.09,27.03 | R19.2 46.99,31.93 v46.99,32.75 | v46.99,35.29 v45.09,35.29
  Bottom 0.406: v36.83,23.86 v36.83,26.42 | v45.09,27.03 v45.09,35.29 | v46.99,32.75 v46.99,35.29
VCC  (via drill 0.6)
  Top 0.406: U10.8 83.82,42.27 82.87,42.91 C16.1 82.55,44.44 82.55,44.81 81.92,45.45 74.93,45.45 74.3,46.08 74.3,46.72 73.03,47.99 68.58,47.99 67.31,49.26 67.31,51.8 66.67,52.43 D14.C v64.14,52.43 | R10.2 R9.2 19.05,44.55 R17.2 20.32,43.81 20.32,44.18 20.95,44.81 v28.57,44.81 | v64.14,42.91 46.99,42.91 45.72,43.54 D13.C v42.55,43.54 | v42.55,35.29 v30.48,35.29
  Bottom 0.406: v64.14,52.43 v64.14,42.91 | v42.55,43.54 v42.55,35.29 | v30.48,35.29 30.48,44.81 v28.57,44.81
VIN  (via drill 0.6)
  Top 0.406: U3.2 U3.1 41.91,21.1 | C11.1 40.16,21.1 41.91,21.1 | R8.2 46.69,24.49 Q2.1 46.05,23.86 v41.91,23.86 41.91,21.1 | v43.81,31.48 v41.91,31.48 D3.C 37.47,32.36 v37.47,33.38 | D9.C 42.16,34.02 42.16,33.77 42.55,33.38 v43.81,33.38 | v75.56,49.26 75.68,49.37 C17.1 74.09,52.12 U4.1 72.7,52.12 72.39,52.43 72.39,53.7 72.41,53.7 72.7,54 73.67,54 U4.3 73.66,54.05 v73.66,55.61 | v75.56,46.72 77.47,46.72 77.47,46.82 78.15,47.5 78.15,48.97 D5.C | v39.37,56.24 37.47,54.34 37.47,49.89 D1.C 37.71,47.6 v37.47,47.35 | SW_PWR.2 v48.26,56.24 49.53,54.97 62.23,54.97 63.5,53.7 67.94,53.7 v69.85,55.61
  Bottom 0.406: v41.91,31.48 v41.91,23.86 | v43.81,31.48 v43.81,33.38 | v75.56,49.26 v75.56,46.72 | v48.26,56.24 v39.37,56.24 | v69.85,55.61 v73.66,55.61 | v37.47,47.35 v37.47,33.38

### Text on the board
tPlace: - | + | ON | B | A | GND | RESET | GND | CTS | A | RX | RTS | TX | B | A | GND | RESET | DIN | DOUT | 3.3V | RTS | CTS | B | ON | GND | B | A | ON | + | - | GND
bPlace: - | + | GND | A | B | GND | A | B | + | -